# Altium project DC075B.PrjPcb (part 4 of 7)

## Sheet DC075B_ANALOG_INPUTS.SchDoc: ANALOG INPUTS
size 558 x 431 mm; DrawnBy: Praveen Aroul; DocumentNumber: 5; SheetNumber: 5; SheetTotal: 13; PageSetup: Record=PageOptions|CenterHorizontal=True|CenterVertical=True|PrintScale=1.00|XCorrection=1.00|YCorrection=1.00|PrintKind=0|BorderSize=5000000|LeftOffset=0|BottomOffset=0|Orientation=2|PaperLength=1000|PaperWidth=1000|Scale=100|PaperSource=15|PrintQuality=600|MediaType=1|DitherType=10|PaperKind=Letter|PrintScaleMode=1
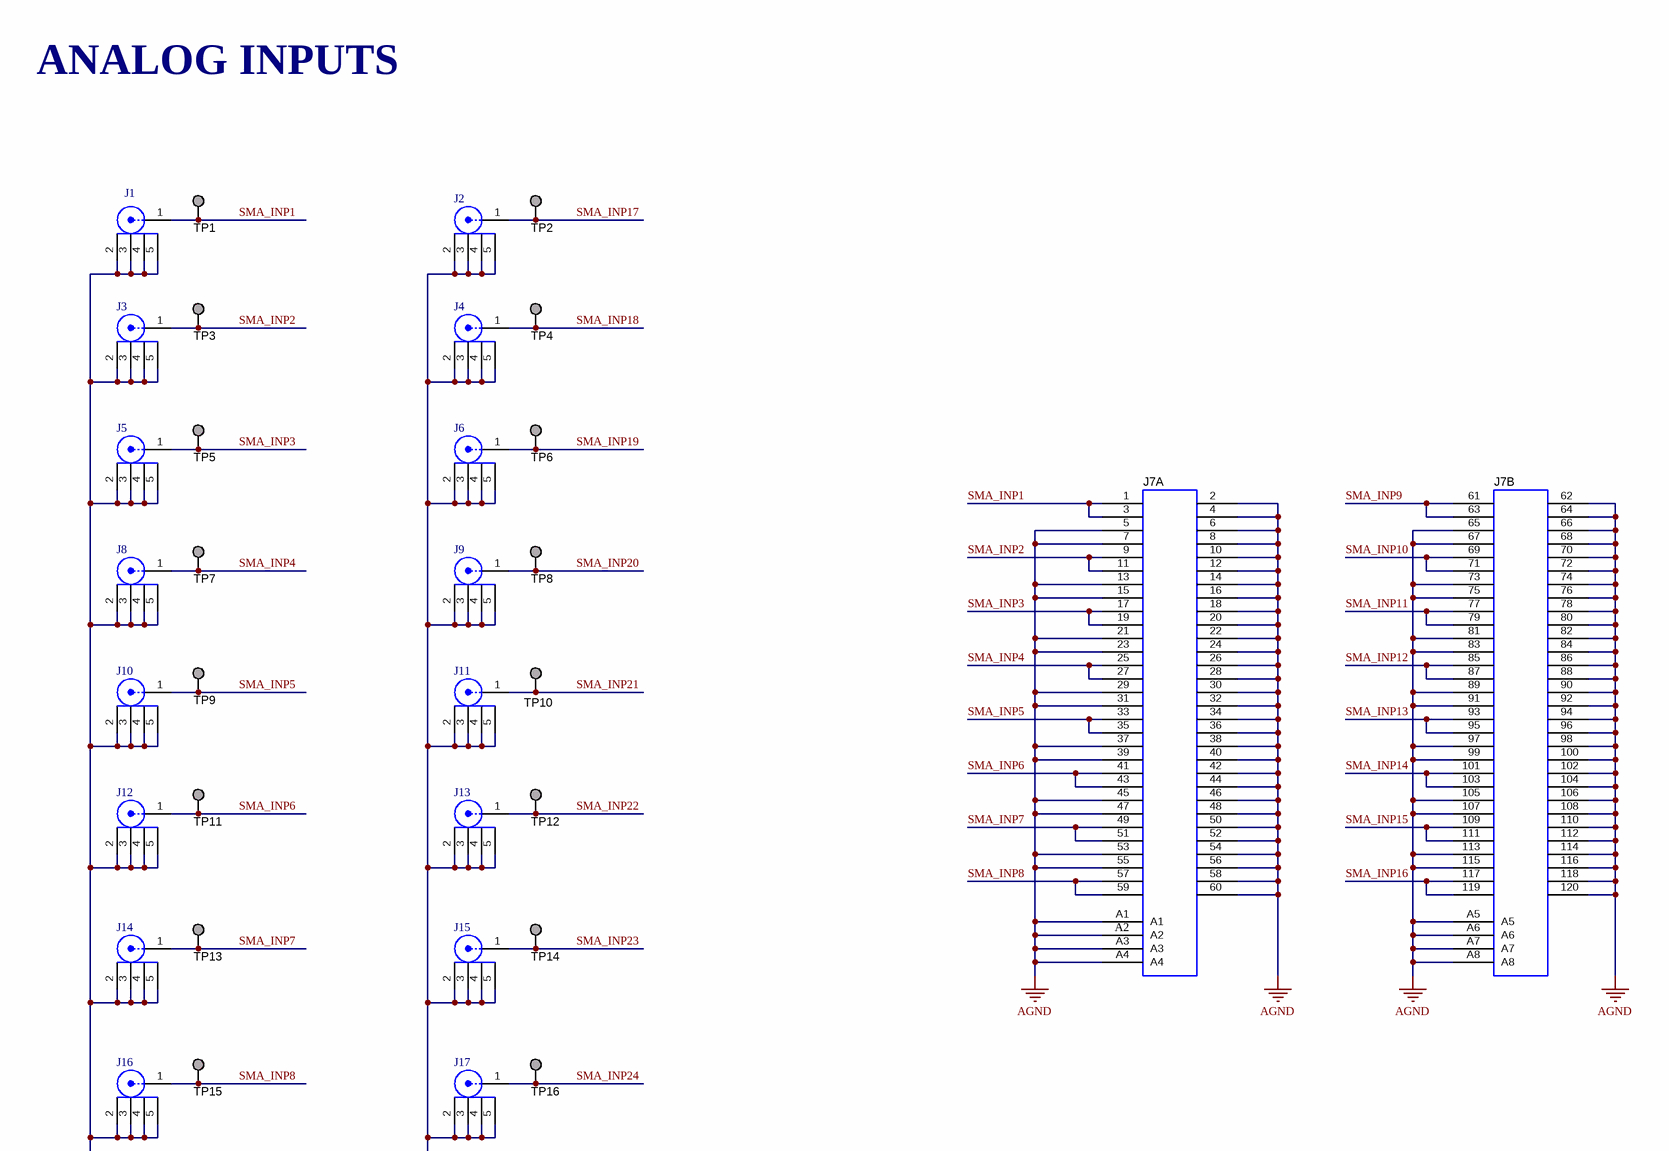
[diagram p11: DC075B_ANALOG_INPUTS.SchDoc, top left]
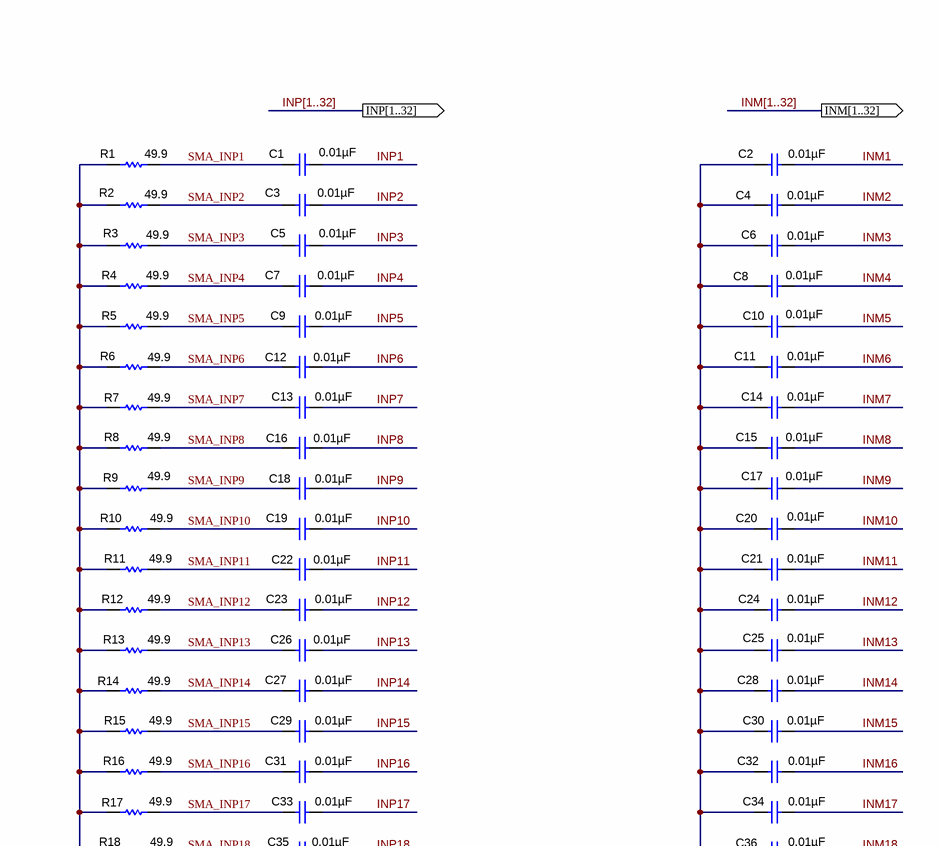
[diagram p12: DC075B_ANALOG_INPUTS.SchDoc, top right]
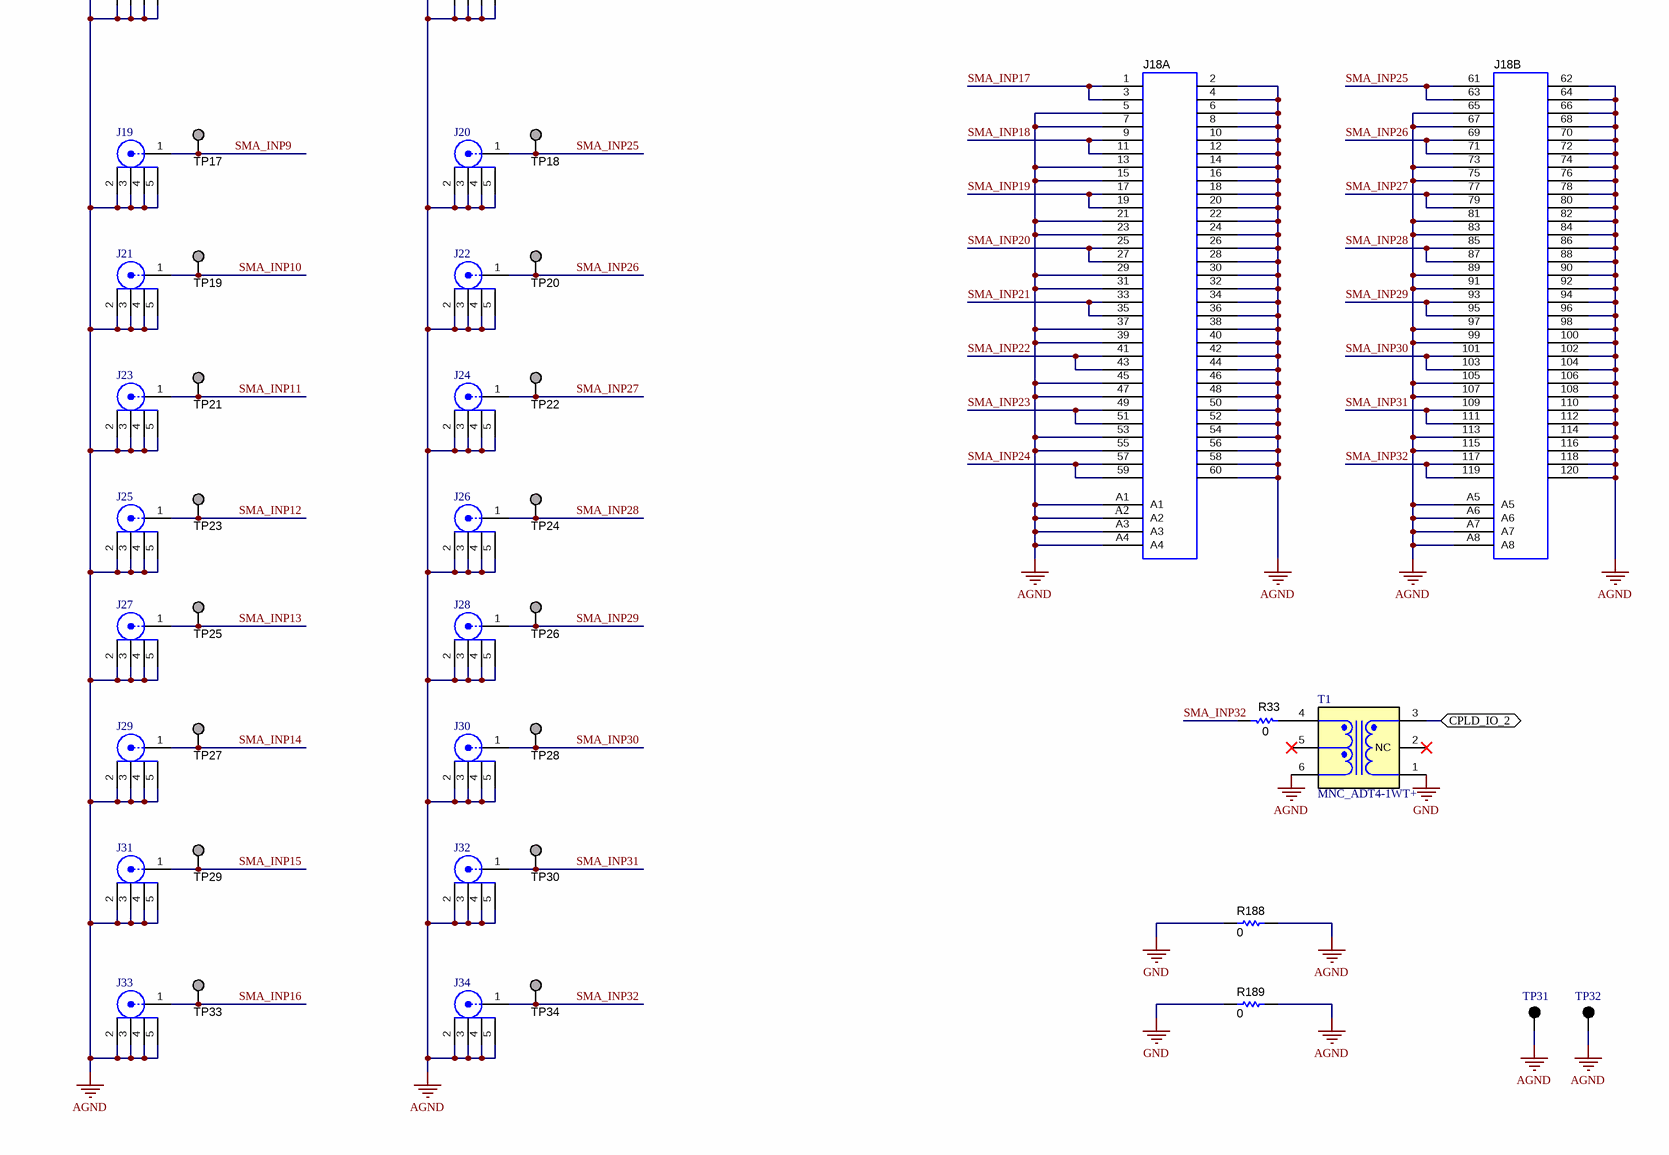
[diagram p13: DC075B_ANALOG_INPUTS.SchDoc, bottom left]
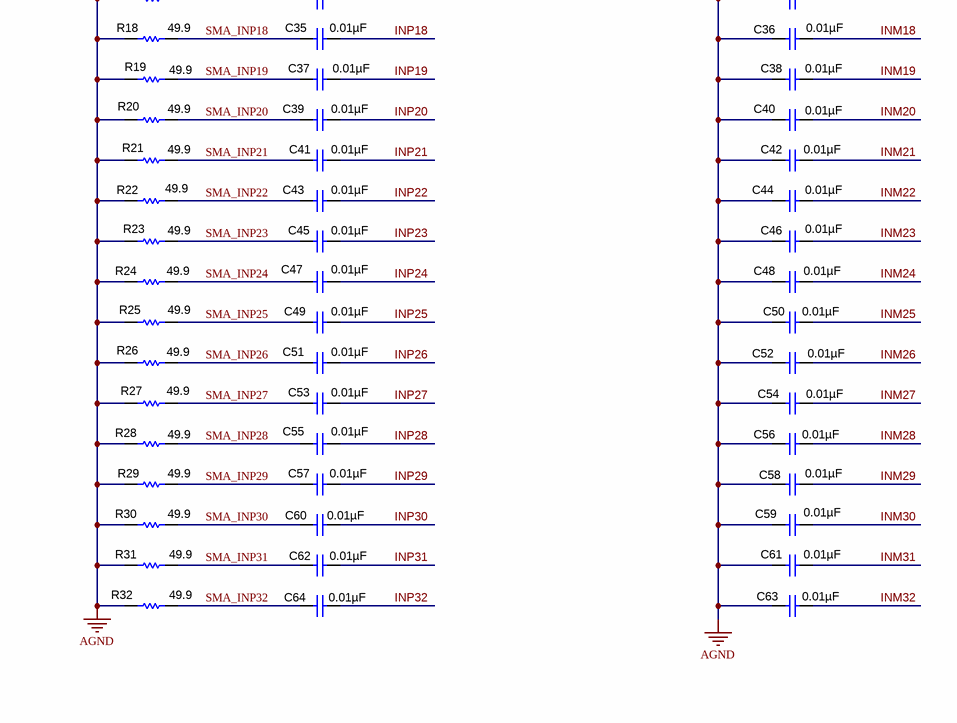
[diagram p14: DC075B_ANALOG_INPUTS.SchDoc, bottom right]

### Parts
C1  ValueDisplayed: 0.01µF  [0402]  (hidden comment: 04023C103JAT2A)
C2  ValueDisplayed: 0.01µF  [0402]  (hidden comment: 04023C103JAT2A)
C3  ValueDisplayed: 0.01µF  [0402]  (hidden comment: 04023C103JAT2A)
C4  ValueDisplayed: 0.01µF  [0402]  (hidden comment: 04023C103JAT2A)
C5  ValueDisplayed: 0.01µF  [0402]  (hidden comment: 04023C103JAT2A)
C6  ValueDisplayed: 0.01µF  [0402]  (hidden comment: 04023C103JAT2A)
C7  ValueDisplayed: 0.01µF  [0402]  (hidden comment: 04023C103JAT2A)
C8  ValueDisplayed: 0.01µF  [0402]  (hidden comment: 04023C103JAT2A)
C9  ValueDisplayed: 0.01µF  [0402]  (hidden comment: 04023C103JAT2A)
C10  ValueDisplayed: 0.01µF  [0402]  (hidden comment: 04023C103JAT2A)
C11  ValueDisplayed: 0.01µF  [0402]  (hidden comment: 04023C103JAT2A)
C12  ValueDisplayed: 0.01µF  [0402]  (hidden comment: 04023C103JAT2A)
C13  ValueDisplayed: 0.01µF  [0402]  (hidden comment: 04023C103JAT2A)
C14  ValueDisplayed: 0.01µF  [0402]  (hidden comment: 04023C103JAT2A)
C15  ValueDisplayed: 0.01µF  [0402]  (hidden comment: 04023C103JAT2A)
C16  ValueDisplayed: 0.01µF  [0402]  (hidden comment: 04023C103JAT2A)
C17  ValueDisplayed: 0.01µF  [0402]  (hidden comment: 04023C103JAT2A)
C18  ValueDisplayed: 0.01µF  [0402]  (hidden comment: 04023C103JAT2A)
C19  ValueDisplayed: 0.01µF  [0402]  (hidden comment: 04023C103JAT2A)
C20  ValueDisplayed: 0.01µF  [0402]  (hidden comment: 04023C103JAT2A)
C21  ValueDisplayed: 0.01µF  [0402]  (hidden comment: 04023C103JAT2A)
C22  ValueDisplayed: 0.01µF  [0402]  (hidden comment: 04023C103JAT2A)
C23  ValueDisplayed: 0.01µF  [0402]  (hidden comment: 04023C103JAT2A)
C24  ValueDisplayed: 0.01µF  [0402]  (hidden comment: 04023C103JAT2A)
C25  ValueDisplayed: 0.01µF  [0402]  (hidden comment: 04023C103JAT2A)
C26  ValueDisplayed: 0.01µF  [0402]  (hidden comment: 04023C103JAT2A)
C27  ValueDisplayed: 0.01µF  [0402]  (hidden comment: 04023C103JAT2A)
C28  ValueDisplayed: 0.01µF  [0402]  (hidden comment: 04023C103JAT2A)
C29  ValueDisplayed: 0.01µF  [0402]  (hidden comment: 04023C103JAT2A)
C30  ValueDisplayed: 0.01µF  [0402]  (hidden comment: 04023C103JAT2A)
C31  ValueDisplayed: 0.01µF  [0402]  (hidden comment: 04023C103JAT2A)
C32  ValueDisplayed: 0.01µF  [0402]  (hidden comment: 04023C103JAT2A)
C33  ValueDisplayed: 0.01µF  [0402]  (hidden comment: 04023C103JAT2A)
C34  ValueDisplayed: 0.01µF  [0402]  (hidden comment: 04023C103JAT2A)
C35  ValueDisplayed: 0.01µF  [0402]  (hidden comment: 04023C103JAT2A)
C36  ValueDisplayed: 0.01µF  [0402]  (hidden comment: 04023C103JAT2A)
C37  ValueDisplayed: 0.01µF  [0402]  (hidden comment: 04023C103JAT2A)
C38  ValueDisplayed: 0.01µF  [0402]  (hidden comment: 04023C103JAT2A)
C39  ValueDisplayed: 0.01µF  [0402]  (hidden comment: 04023C103JAT2A)
C40  ValueDisplayed: 0.01µF  [0402]  (hidden comment: 04023C103JAT2A)
C41  ValueDisplayed: 0.01µF  [0402]  (hidden comment: 04023C103JAT2A)
C42  ValueDisplayed: 0.01µF  [0402]  (hidden comment: 04023C103JAT2A)
C43  ValueDisplayed: 0.01µF  [0402]  (hidden comment: 04023C103JAT2A)
C44  ValueDisplayed: 0.01µF  [0402]  (hidden comment: 04023C103JAT2A)
C45  ValueDisplayed: 0.01µF  [0402]  (hidden comment: 04023C103JAT2A)
C46  ValueDisplayed: 0.01µF  [0402]  (hidden comment: 04023C103JAT2A)
C47  ValueDisplayed: 0.01µF  [0402]  (hidden comment: 04023C103JAT2A)
C48  ValueDisplayed: 0.01µF  [0402]  (hidden comment: 04023C103JAT2A)
C49  ValueDisplayed: 0.01µF  [0402]  (hidden comment: 04023C103JAT2A)
C50  ValueDisplayed: 0.01µF  [0402]  (hidden comment: 04023C103JAT2A)
C51  ValueDisplayed: 0.01µF  [0402]  (hidden comment: 04023C103JAT2A)
C52  ValueDisplayed: 0.01µF  [0402]  (hidden comment: 04023C103JAT2A)
C53  ValueDisplayed: 0.01µF  [0402]  (hidden comment: 04023C103JAT2A)
C54  ValueDisplayed: 0.01µF  [0402]  (hidden comment: 04023C103JAT2A)
C55  ValueDisplayed: 0.01µF  [0402]  (hidden comment: 04023C103JAT2A)
C56  ValueDisplayed: 0.01µF  [0402]  (hidden comment: 04023C103JAT2A)
C57  ValueDisplayed: 0.01µF  [0402]  (hidden comment: 04023C103JAT2A)
C58  ValueDisplayed: 0.01µF  [0402]  (hidden comment: 04023C103JAT2A)
C59  ValueDisplayed: 0.01µF  [0402]  (hidden comment: 04023C103JAT2A)
C60  ValueDisplayed: 0.01µF  [0402]  (hidden comment: 04023C103JAT2A)
C61  ValueDisplayed: 0.01µF  [0402]  (hidden comment: 04023C103JAT2A)
C62  ValueDisplayed: 0.01µF  [0402]  (hidden comment: 04023C103JAT2A)
C63  ValueDisplayed: 0.01µF  [0402]  (hidden comment: 04023C103JAT2A)
C64  ValueDisplayed: 0.01µF  [0402]  (hidden comment: 04023C103JAT2A)
J1  SMA_Contact1_GND2345  [Johnson_142-0701-801]  (value not drawn)
J2  5-1814832-1  [TE_5-1814832-1]  (value not drawn)
J3  5-1814832-1  [TE_5-1814832-1]  (value not drawn)
J4  SMA_Contact1_GND2345  [Johnson_142-0701-801]  (value not drawn)
J5  5-1814832-1  [TE_5-1814832-1]  (value not drawn)
J6  5-1814832-1  [TE_5-1814832-1]  (value not drawn)
J7  SAMTEC_QTH-060-01-L-D-A  [SAMTEC_QTH-060-01-L-D-A]  (value not drawn)  (parts A,B of 2)
J8  SMA_Contact1_GND2345  [Johnson_142-0701-801]  (value not drawn)
J9  5-1814832-1  [TE_5-1814832-1]  (value not drawn)
J10  5-1814832-1  [TE_5-1814832-1]  (value not drawn)
J11  SMA_Contact1_GND2345  [Johnson_142-0701-801]  (value not drawn)
J12  5-1814832-1  [TE_5-1814832-1]  (value not drawn)
J13  5-1814832-1  [TE_5-1814832-1]  (value not drawn)
J14  SMA_Contact1_GND2345  [Johnson_142-0701-801]  (value not drawn)
J15  5-1814832-1  [TE_5-1814832-1]  (value not drawn)
J16  5-1814832-1  [TE_5-1814832-1]  (value not drawn)
J17  SMA_Contact1_GND2345  [Johnson_142-0701-801]  (value not drawn)
J18  SAMTEC_QTH-060-01-L-D-A  [SAMTEC_QTH-060-01-L-D-A]  (value not drawn)  (parts A,B of 2)
J19  5-1814832-1  [TE_5-1814832-1]  (value not drawn)
J20  5-1814832-1  [TE_5-1814832-1]  (value not drawn)
J21  SMA_Contact1_GND2345  [Johnson_142-0701-801]  (value not drawn)
J22  5-1814832-1  [TE_5-1814832-1]  (value not drawn)
J23  5-1814832-1  [TE_5-1814832-1]  (value not drawn)
J24  SMA_Contact1_GND2345  [Johnson_142-0701-801]  (value not drawn)
J25  5-1814832-1  [TE_5-1814832-1]  (value not drawn)
J26  5-1814832-1  [TE_5-1814832-1]  (value not drawn)
J27  SMA_Contact1_GND2345  [Johnson_142-0701-801]  (value not drawn)
J28  5-1814832-1  [TE_5-1814832-1]  (value not drawn)
J29  5-1814832-1  [TE_5-1814832-1]  (value not drawn)
J30  SMA_Contact1_GND2345  [Johnson_142-0701-801]  (value not drawn)
J31  5-1814832-1  [TE_5-1814832-1]  (value not drawn)
J32  5-1814832-1  [TE_5-1814832-1]  (value not drawn)
J33  5-1814832-1  [TE_5-1814832-1]  (value not drawn)
J34  5-1814832-1  [TE_5-1814832-1]  (value not drawn)
R1  value 49.9  [0402]  (hidden comment: Resistor)
R2  value 49.9  [0402]  (hidden comment: Resistor)
R3  value 49.9  [0402]  (hidden comment: Resistor)
R4  value 49.9  [0402]  (hidden comment: Resistor)
R5  value 49.9  [0402]  (hidden comment: Resistor)
R6  value 49.9  [0402]  (hidden comment: Resistor)
R7  value 49.9  [0402]  (hidden comment: Resistor)
R8  value 49.9  [0402]  (hidden comment: Resistor)
R9  value 49.9  [0402]  (hidden comment: Resistor)
R10  value 49.9  [0402]  (hidden comment: Resistor)
R11  value 49.9  [0402]  (hidden comment: Resistor)
R12  value 49.9  [0402]  (hidden comment: Resistor)
R13  value 49.9  [0402]  (hidden comment: Resistor)
R14  value 49.9  [0402]  (hidden comment: Resistor)
R15  value 49.9  [0402]  (hidden comment: Resistor)
R16  value 49.9  [0402]  (hidden comment: Resistor)
R17  value 49.9  [0402]  (hidden comment: Resistor)
R18  value 49.9  [0402]  (hidden comment: Resistor)
R19  value 49.9  [0402]  (hidden comment: Resistor)
R20  value 49.9  [0402]  (hidden comment: Resistor)
R21  value 49.9  [0402]  (hidden comment: Resistor)
R22  value 49.9  [0402]  (hidden comment: Resistor)
R23  value 49.9  [0402]  (hidden comment: Resistor)
R24  value 49.9  [0402]  (hidden comment: Resistor)
R25  value 49.9  [0402]  (hidden comment: Resistor)
R26  value 49.9  [0402]  (hidden comment: Resistor)
R27  value 49.9  [0402]  (hidden comment: Resistor)
R28  value 49.9  [0402]  (hidden comment: Resistor)
R29  value 49.9  [0402]  (hidden comment: Resistor)
R30  value 49.9  [0402]  (hidden comment: Resistor)
R31  value 49.9  [0402]  (hidden comment: Resistor)
R32  value 49.9  [0402]  (hidden comment: Resistor)
R33  value 0  [0402]  (hidden comment: Resistor)
R188  ValueDisplayed: 0  [0805_HV]  (hidden comment: Resistor)
R189  ValueDisplayed: 0  [0805_HV]  (hidden comment: Resistor)
T1  MNC_ADT4-1WT+  [MNC_CD542]
TP1  Testpoint_Gray  [Keystone_5019]  (value not drawn)
TP2  Testpoint_Gray  [Keystone_5019]  (value not drawn)
TP3  Testpoint_Gray  [Keystone_5019]  (value not drawn)
TP4  Testpoint_Gray  [Keystone_5019]  (value not drawn)
TP5  Testpoint_Gray  [Keystone_5019]  (value not drawn)
TP6  Testpoint_Gray  [Keystone_5019]  (value not drawn)
TP7  Testpoint_Gray  [Keystone_5019]  (value not drawn)
TP8  Testpoint_Gray  [Keystone_5019]  (value not drawn)
TP9  Testpoint_Gray  [Keystone_5019]  (value not drawn)
TP10  Testpoint_Gray  [Keystone_5019]  (value not drawn)
TP11  Testpoint_Gray  [Keystone_5019]  (value not drawn)
TP12  Testpoint_Gray  [Keystone_5019]  (value not drawn)
TP13  Testpoint_Gray  [Keystone_5019]  (value not drawn)
TP14  Testpoint_Gray  [Keystone_5019]  (value not drawn)
TP15  Testpoint_Gray  [Keystone_5019]  (value not drawn)
TP16  Testpoint_Gray  [Keystone_5019]  (value not drawn)
TP17  Testpoint_Gray  [Keystone_5019]  (value not drawn)
TP18  Testpoint_Gray  [Keystone_5019]  (value not drawn)
TP19  Testpoint_Gray  [Keystone_5019]  (value not drawn)
TP20  Testpoint_Gray  [Keystone_5019]  (value not drawn)
TP21  Testpoint_Gray  [Keystone_5019]  (value not drawn)
TP22  Testpoint_Gray  [Keystone_5019]  (value not drawn)
TP23  Testpoint_Gray  [Keystone_5019]  (value not drawn)
TP24  Testpoint_Gray  [Keystone_5019]  (value not drawn)
TP25  Testpoint_Gray  [Keystone_5019]  (value not drawn)
TP26  Testpoint_Gray  [Keystone_5019]  (value not drawn)
TP27  Testpoint_Gray  [Keystone_5019]  (value not drawn)
TP28  Testpoint_Gray  [Keystone_5019]  (value not drawn)
TP29  Testpoint_Gray  [Keystone_5019]  (value not drawn)
TP30  Testpoint_Gray  [Keystone_5019]  (value not drawn)
TP31  5001  [Keystone5001]  (value not drawn)
TP32  5001  [Keystone5001]  (value not drawn)
TP33  Testpoint_Gray  [Keystone_5019]  (value not drawn)
TP34  Testpoint_Gray  [Keystone_5019]  (value not drawn)

### Ports
CPLD_IO_2, INM[1..32] (out), INP[1..32] (out)

### Nets
AGND: C2.2 C4.2 C6.2 C8.2 C10.2 C11.2 C14.2 C15.2 C17.2 C20.2 C21.2 C24.2 C25.2 C28.2 C30.2 C32.2 C34.2 C36.2 C38.2 C40.2 C42.2 C44.2 C46.2 C48.2 C50.2 C52.2 C54.2 C56.2 C58.2 C59.2 C61.2 C63.2 J1.2 J1.3 J1.4 J1.5 J2.2 J2.3 J2.4 J2.5 J3.2 J3.3 J3.4 J3.5 J4.2 J4.3 J4.4 J4.5 J5.2 J5.3 J5.4 J5.5 J6.2 J6.3 J6.4 J6.5 J7.2 J7.4 J7.5 J7.6 J7.7 J7.8 J7.10 J7.12 J7.13 J7.14 J7.15 J7.16 J7.18 J7.20 J7.21 J7.22 J7.23 J7.24 J7.26 J7.28 J7.29 J7.30 J7.31 J7.32 J7.34 J7.36 J7.37 J7.38 J7.39 J7.40 J7.42 J7.44 J7.45 J7.46 J7.47 J7.48 J7.50 J7.52 J7.53 J7.54 J7.55 J7.56 J7.58 J7.60 J7.62 J7.64 J7.65 J7.66 J7.67 J7.68 J7.70 J7.72 J7.73 J7.74 J7.75 J7.76 J7.78 J7.80 J7.81 J7.82 J7.83 J7.84 J7.86 J7.88 J7.89 J7.90 J7.91 J7.92 J7.94 J7.96 J7.97 J7.98 J7.99 J7.100 J7.102 J7.104 J7.105 J7.106 J7.107 J7.108 J7.110 J7.112 J7.113 J7.114 J7.115 J7.116 J7.118 J7.120 J7.A1 J7.A2 J7.A3 J7.A4 J7.A5 J7.A6 J7.A7 J7.A8 J8.2 J8.3 J8.4 J8.5 J9.2 J9.3 J9.4 J9.5 J10.2 J10.3 J10.4 J10.5 J11.2 J11.3 J11.4 J11.5 J12.2 J12.3 J12.4 J12.5 J13.2 J13.3 J13.4 J13.5 J14.2 J14.3 J14.4 J14.5 J15.2 J15.3 J15.4 J15.5 J16.2 J16.3 J16.4 J16.5 J17.2 J17.3 J17.4 J17.5 J18.2 J18.4 J18.5 J18.6 J18.7 J18.8 J18.10 J18.12 J18.13 J18.14 J18.15 J18.16 J18.18 J18.20 J18.21 J18.22 J18.23 J18.24 J18.26 J18.28 J18.29 J18.30 J18.31 J18.32 J18.34 J18.36 J18.37 J18.38 J18.39 J18.40 J18.42 J18.44 J18.45 J18.46 J18.47 J18.48 J18.50 J18.52 J18.53 J18.54 J18.55 J18.56 J18.58 J18.60 J18.62 J18.64 J18.65 J18.66 J18.67 J18.68 J18.70 J18.72 J18.73 J18.74 J18.75 J18.76 J18.78 J18.80 J18.81 J18.82 J18.83 J18.84 J18.86 J18.88 J18.89 J18.90 J18.91 J18.92 J18.94 J18.96 J18.97 J18.98 J18.99 J18.100 J18.102 J18.104 J18.105 J18.106 J18.107 J18.108 J18.110 J18.112 J18.113 J18.114 J18.115 J18.116 J18.118 J18.120 J18.A1 J18.A2 J18.A3 J18.A4 J18.A5 J18.A6 J18.A7 J18.A8 J19.2 J19.3 J19.4 J19.5 J20.2 J20.3 J20.4 J20.5 J21.2 J21.3 J21.4 J21.5 J22.2 J22.3 J22.4 J22.5 J23.2 J23.3 J23.4 J23.5 J24.2 J24.3 J24.4 J24.5 J25.2 J25.3 J25.4 J25.5 J26.2 J26.3 J26.4 J26.5 J27.2 J27.3 J27.4 J27.5 J28.2 J28.3 J28.4 J28.5 J29.2 J29.3 J29.4 J29.5 J30.2 J30.3 J30.4 J30.5 J31.2 J31.3 J31.4 J31.5 J32.2 J32.3 J32.4 J32.5 J33.2 J33.3 J33.4 J33.5 J34.2 J34.3 J34.4 J34.5 R1.1 R2.1 R3.1 R4.1 R5.1 R6.1 R7.1 R8.1 R9.1 R10.1 R11.1 R12.1 R13.1 R14.1 R15.1 R16.1 R17.1 R18.1 R19.1 R20.1 R21.1 R22.1 R23.1 R24.1 R25.1 R26.1 R27.1 R28.1 R29.1 R30.1 R31.1 R32.1 R188.2 R189.2 T1.6 TP31.1 TP32.1
GND: R188.1 R189.1 T1.1
CPLD_IO_2: T1.3 ; port CPLD_IO_2
INM1: C2.1
INM2: C4.1
INM3: C6.1
INM4: C8.1
INM5: C10.1
INM6: C11.1
INM7: C14.1
INM8: C15.1
INM9: C17.1
INM10: C20.1
INM11: C21.1
INM12: C24.1
INM13: C25.1
INM14: C28.1
INM15: C30.1
INM16: C32.1
INM17: C34.1
INM18: C36.1
INM19: C38.1
INM20: C40.1
INM21: C42.1
INM22: C44.1
INM23: C46.1
INM24: C48.1
INM25: C50.1
INM26: C52.1
INM27: C54.1
INM28: C56.1
INM29: C58.1
INM30: C59.1
INM31: C61.1
INM32: C63.1
INP1: C1.1
INP2: C3.1
INP3: C5.1
INP4: C7.1
INP5: C9.1
INP6: C12.1
INP7: C13.1
INP8: C16.1
INP9: C18.1
INP10: C19.1
INP11: C22.1
INP12: C23.1
INP13: C26.1
INP14: C27.1
INP15: C29.1
INP16: C31.1
INP17: C33.1
INP18: C35.1
INP19: C37.1
INP20: C39.1
INP21: C41.1
INP22: C43.1
INP23: C45.1
INP24: C47.1
INP25: C49.1
INP26: C51.1
INP27: C53.1
INP28: C55.1
INP29: C57.1
INP30: C60.1
INP31: C62.1
INP32: C64.1
SMA_INP1: C1.2 J1.1 J7.1 J7.3 R1.2 TP1.1
SMA_INP2: C3.2 J3.1 J7.9 J7.11 R2.2 TP3.1
SMA_INP3: C5.2 J5.1 J7.17 J7.19 R3.2 TP5.1
SMA_INP4: C7.2 J7.25 J7.27 J8.1 R4.2 TP7.1
SMA_INP5: C9.2 J7.33 J7.35 J10.1 R5.2 TP9.1
SMA_INP6: C12.2 J7.41 J7.43 J12.1 R6.2 TP11.1
SMA_INP7: C13.2 J7.49 J7.51 J14.1 R7.2 TP13.1
SMA_INP8: C16.2 J7.57 J7.59 J16.1 R8.2 TP15.1
SMA_INP9: C18.2 J7.61 J7.63 J19.1 R9.2 TP17.1
SMA_INP10: C19.2 J7.69 J7.71 J21.1 R10.2 TP19.1
SMA_INP11: C22.2 J7.77 J7.79 J23.1 R11.2 TP21.1
SMA_INP12: C23.2 J7.85 J7.87 J25.1 R12.2 TP23.1
SMA_INP13: C26.2 J7.93 J7.95 J27.1 R13.2 TP25.1
SMA_INP14: C27.2 J7.101 J7.103 J29.1 R14.2 TP27.1
SMA_INP15: C29.2 J7.109 J7.111 J31.1 R15.2 TP29.1
SMA_INP16: C31.2 J7.117 J7.119 J33.1 R16.2 TP33.1
SMA_INP17: C33.2 J2.1 J18.1 J18.3 R17.2 TP2.1
SMA_INP18: C35.2 J4.1 J18.9 J18.11 R18.2 TP4.1
SMA_INP19: C37.2 J6.1 J18.17 J18.19 R19.2 TP6.1
SMA_INP20: C39.2 J9.1 J18.25 J18.27 R20.2 TP8.1
SMA_INP21: C41.2 J11.1 J18.33 J18.35 R21.2 TP10.1
SMA_INP22: C43.2 J13.1 J18.41 J18.43 R22.2 TP12.1
SMA_INP23: C45.2 J15.1 J18.49 J18.51 R23.2 TP14.1
SMA_INP24: C47.2 J17.1 J18.57 J18.59 R24.2 TP16.1
SMA_INP25: C49.2 J18.61 J18.63 J20.1 R25.2 TP18.1
SMA_INP26: C51.2 J18.69 J18.71 J22.1 R26.2 TP20.1
SMA_INP27: C53.2 J18.77 J18.79 J24.1 R27.2 TP22.1
SMA_INP28: C55.2 J18.85 J18.87 J26.1 R28.2 TP24.1
SMA_INP29: C57.2 J18.93 J18.95 J28.1 R29.2 TP26.1
SMA_INP30: C60.2 J18.101 J18.103 J30.1 R30.2 TP28.1
SMA_INP31: C62.2 J18.109 J18.111 J32.1 R31.2 TP30.1
SMA_INP32: C64.2 J18.117 J18.119 J34.1 R32.2 R33.2 TP34.1
NetR33_1: R33.1 T1.4

Not connected (* = marked no-connect by the designer): T1 2(NC)* 5*

### Buses and harness runs
bus INM[1..32] = port INM[1..32]
bus INP[1..32] = port INP[1..32]

### Notes on the sheet
- ANALOG INPUTS
- Drawn By:
- SVN Rev:
- Number:
- TID #:
- Orderable:
- Rev:
- Sheet Title:
- File:
- Project Title:
- Designed for:
- Assembly Variant:
- Mod. Date:
- Sheet:
- Size:
- of
- C
- http://www.ti.com
- Texas Instruments and/or its licensors do not warrant the accuracy or completeness of this specification or any information contained therein. Texas Instruments and/or its licensors do not warrant that this design will meet the specifications, will be suitable for your application or fit for any particular purpose, or will operate in an implementation. Texas Instruments and/or its licensors do not warrant that the design is production worthy. You should completely validate and test your design implementation to confirm the system functionality for your application.
- Engineer:
- Contact:
- © Texas Instruments

### Library data of the parts
C1-C64 = CMP-0085568-1: CAP, CERM, 0.01 µF, 25 V,+/- 5%, X7R, 0402; Manufacturer: AVX; Polarized: N; Value: 0.01uF; U/M: EA; Cap_F: 10nF; VDC_V: 25V; TaMin_C: -55°C; TaMax_C: 125°C; AEC Category: Q200; SizeArea_mm2: 0.5; SizeAreaWB_mm2: 3; SizeX_mm: 1; SizeZ_mm: 0.6; CompType: Capacitor; PartNumber: 04023C103JAT2A; PackageReference: 0402; RoHS: Y; Tolerance_%: 5%; Value2: 25V; MountType: SMT; Technology: Ceramic; TempCo: X7R; Cap_Case: 0402; ComponentLink1Description: Datasheet link; ComponentLink1URL: http://datasheets.avx.com/X7RDielectric.pdf; AEC Grade: N/A; AEC Qualified: N; SizeY_mm: 0.5
J1 J4 J8 J11 J14 J17 J21 J24 J27 J30 = CMP-0055828-1: Connector, End launch SMA, 50 ohm, SMT; PartNumber: 142-0701-801; Manufacturer: Cinch Connectivity; CNHeader: FALSE; CT: TRUE; Green_Lifecycle: Not Set; Green_REACh: Incomplete; PackageReference: End Launch SMA; CompType: SMA; RoHS: Y; MountType: SMT; ComponentLink1Description: Datasheet URL; ComponentLink1URL: http://emersonconnectivity.com/OA_MEDIA/specs/pi-142-0701-801.pdf; Publisher: Texas Instruments; LatestRevisionDate: 26/05/2017; Supplier 1: Digi-Key; Supplier Part Number 1: J502-ND; Supplier 2: Newark; Supplier Part Number 2: 90F2624; Supplier 3: Mouser; Supplier Part Number 3: 530-142-0701-801; Green_EU RoHS-2: Incomplete; Green_EU RoHS: Incomplete
J2 J3 J5 J6 J9 J10 J12 J13 J15 J16 J19 J20 J22 J23 J25 J26 J28 J29 J31-J34 = CMP-0054990-1: SMA Straight PCB Socket Die Cast, 50 Ohm, TH; Manufacturer: TE Connectivity; Green_Lifecycle: Active; Green_REACh: Passed; CNHeader: FALSE; CT: TRUE; PartNumber: 5-1814832-1; PackageReference: SMA Straight PCB Socket Die Cast, TH; CompType: SMA; RoHS: Y; MountType: TH; ComponentLink1Description: Datasheet URL; ComponentLink1URL: http://www.te.com/commerce/DocumentDelivery/DDEController?Action=srchrtrv&DocNm=1814832&DocType=Customer+Drawing&DocLang=English; Supplier 1: Digi-Key; Supplier Part Number 1: A97594-ND; Supplier 2: Newark; Supplier Part Number 2: 78M7270; Supplier 3: Mouser; Supplier Part Number 3: 571-5-1814832-1; Green_EU RoHS-2: Incomplete; Green_EU RoHS: Passed with Exemption; Publisher: Texas Instruments; LatestRevisionDate: 26/05/2017
J7 J18 = CMP-0056023-2: Socket, 0.5MM, 60x2, Gold, SMT; Manufacturer: Samtec; Green_Lifecycle: Not Set; Green_REACh: Incomplete; PartNumber: QTH-060-01-L-D-A; PackageReference: Socket, Female, 0.5MM, 60x2, SMT; CompType: Socket; RoHS: Y; MountType: SMT; ComponentLink1Description: Datasheet URL; ComponentLink1URL: http://www.samtec.com/documents/webfiles/cpdf/QTH-XXX-XX-X-D-XXX-MKT.pdf; Supplier 1: Digi-Key; Supplier Part Number 1: SAM8189-ND; Supplier 2: Newark; Supplier Part Number 2: 11P6110; Supplier 3: Farnell; Supplier Part Number 3: 1667909; Green_EU RoHS-2: Incomplete; Green_EU RoHS: Incomplete
R1-R32 = CMP-0026404-2: RES, 49.9, 1%, 0.063 W, AEC-Q200 Grade 0, 0402; Manufacturer: Vishay-Dale; PartNumber: CRCW040249R9FKED; Value_Code: 49R9; Power_W: 63mW; Value2: 0.063W; VDC_V: 50V; TempCo: 100 ppm/C; EIA_Code: E96; AEC Category: Q200; AEC Grade: 0; AEC Qualified: Y; SizeArea_mm2: 0.5; SizeX_mm: 1; SizeZ_mm: 0.6; ComponentLink1Description: Datasheet link; ComponentLink1URL: http://www.vishay.com/docs/20035/dcrcwe3.pdf; CompType: Resistor; MountType: SMT; PackageReference: 0402; RoHS: E; ValueDisplayed: 49.9; Res_ohm: 49.9; Tolerance_%: 1%; Value1: 1%; Technology: Thick Film; Supplier 1: Digi-Key; Supplier Part Number 1: 541-49.9LCT-ND; Supplier 2: Newark; Supplier Part Number 2: 52K7114; Supplier 3: Mouser; Supplier Part Number 3: 71-CRCW0402-49.9-E3; SizeY_mm: 0.5
R33 = CMP-0026822-3: RES, 0, 5%, 0.063 W, AEC-Q200 Grade 0, 0402; Manufacturer: Vishay-Dale; PartNumber: CRCW04020000Z0ED; Value_Code: 0000; Power_W: 63mW; Value2: 0.063W; VDC_V: 50V; TempCo: 200 ppm/C; EIA_Code: E24; AEC Category: Q200; AEC Qualified: Y; SizeArea_mm2: 0.5; SizeX_mm: 1; SizeZ_mm: 0.6; ComponentLink1Description: Datasheet link; ComponentLink1URL: http://www.vishay.com/docs/20035/dcrcwe3.pdf; CompType: Resistor; MountType: SMT; PackageReference: 0402; RoHS: E; ValueDisplayed: 0; Res_ohm: 0; Tolerance_%: 5%; Value1: 5%; Technology: Thick Film; Supplier 1: Digi-Key; Supplier Part Number 1: 541-0.0JCT-ND; Supplier 2: Newark; Supplier Part Number 2: 52K6543; Supplier 3: Mouser; Supplier Part Number 3: 71-CRCW0402-0-E3; AEC Grade: 0; SizeY_mm: 0.5
R188 R189 = CMP-0020802-2: RES, 0, 5%, 0.125 W, 0805; PartNumber: MCR10EZPJ000; Manufacturer: Rohm; Value: 0; Value_Code: 0000; Power_W: 125mW; Value2: 0.125W; VDC_V: 150V; TempCo: 400 ppm/C; SizeArea_mm2: 2.5; SizeX_mm: 2; SizeY_mm: 1.25; SizeZ_mm: 1.45; EIA_Code: E24; U/M: EA; AEC Category: Q200; CompType: Resistor; PackageReference: 0805; RoHS: Y; Res_ohm: 0; Tolerance_%: 5%; Value1: 5%; MountType: SMT; Technology: Thick Film; Published: 2008-06-26; Publisher: Texas Instruments; LatestRevisionDate: 2017-03-09; ComponentLink1Description: Datasheet link; ComponentLink1URL: http://www.rohm.com/products/databook/r/pdf/mcr10.pdf; Supplier 1: Digi-Key; Supplier Part Number 1: RHM0.0ARCT-ND; AEC Qualified: ?
T1 = CMP-0030461-2: RF Transformer, 50 ohm, 2 to 775 MHz, SMT; Manufacturer: Minicircuits; Green_Lifecycle: Not Set; Green_REACh: Incomplete; PartNumber: ADT4-1WT+; CompType: Transformer; PackageReference: CD542; MountType: SMT; RoHS: Y; ComponentLink1Description: Datasheet URL; ComponentLink1URL: http://www.minicircuits.com/pdfs/ADT4-1WT.pdf; Publisher: Texas Instruments; LatestRevisionDate: 2017-05-09; Green_EU RoHS-2: Incomplete; Green_EU RoHS: Incomplete
TP1-TP30 TP33 TP34 = CMP-0055162-1: Test Point, Miniature, SMT; PartNumber: 5019; Manufacturer: Keystone; CNHeader: FALSE; CT: TRUE; Green_Lifecycle: Active; Green_REACh: Passed; CompType: Test Point; PackageReference: Test Point, Miniature, SMT; RoHS: Y; MountType: SMT; ComponentLink1Description: Datasheet URL; ComponentLink1URL: http://www.keyelco.com/product-pdf.cfm?p=1357; Publisher: Texas Instruments; LatestRevisionDate: 26/05/2017; Supplier 1: Digi-Key; Supplier Part Number 1: 36-5019TR-ND; Supplier 2: Mouser; Supplier Part Number 2: 534-5019; Green_EU RoHS-2: Incomplete; Green_EU RoHS: Passed
TP31 TP32 = CMP-0055138-1: Test Point, Miniature, Black, TH; Manufacturer: Keystone; CNHeader: FALSE; ContactFinish: Silver; CT: TRUE; Green_Lifecycle: Active; Green_REACh: Passed; PartNumber: 5001; PackageReference: Black Miniature Testpoint; CompType: Test Point; RoHS: Y; MountType: TH; ComponentLink1Description: Datasheet URL; ComponentLink1URL: http://www.keyelco.com/userAssets/file/M60-2p60.pdf; Publisher: Texas Instruments; LatestRevisionDate: 26/05/2017; Supplier 1: Digi-Key; Supplier Part Number 1: 36-5001-ND; Supplier 2: Mouser; Supplier Part Number 2: 534-5001; Color: Black; Green_EU RoHS-2: Incomplete; Green_EU RoHS: Passed

## Sheet DC075B_DEVICE_PINOUT.SchDoc: DEVICE PINOUT
size 558 x 431 mm; DrawnBy: Praveen Aroul; DocumentNumber: 6; SheetNumber: 6; SheetTotal: 13; PageSetup: Record=PageOptions|CenterHorizontal=True|CenterVertical=True|PrintScale=1.00|XCorrection=1.00|YCorrection=1.00|PrintKind=0|BorderSize=5000000|LeftOffset=0|BottomOffset=0|Orientation=2|PaperLength=1000|PaperWidth=1000|Scale=100|PaperSource=15|PrintQuality=600|MediaType=1|DitherType=10|PaperKind=Letter|PrintScaleMode=1
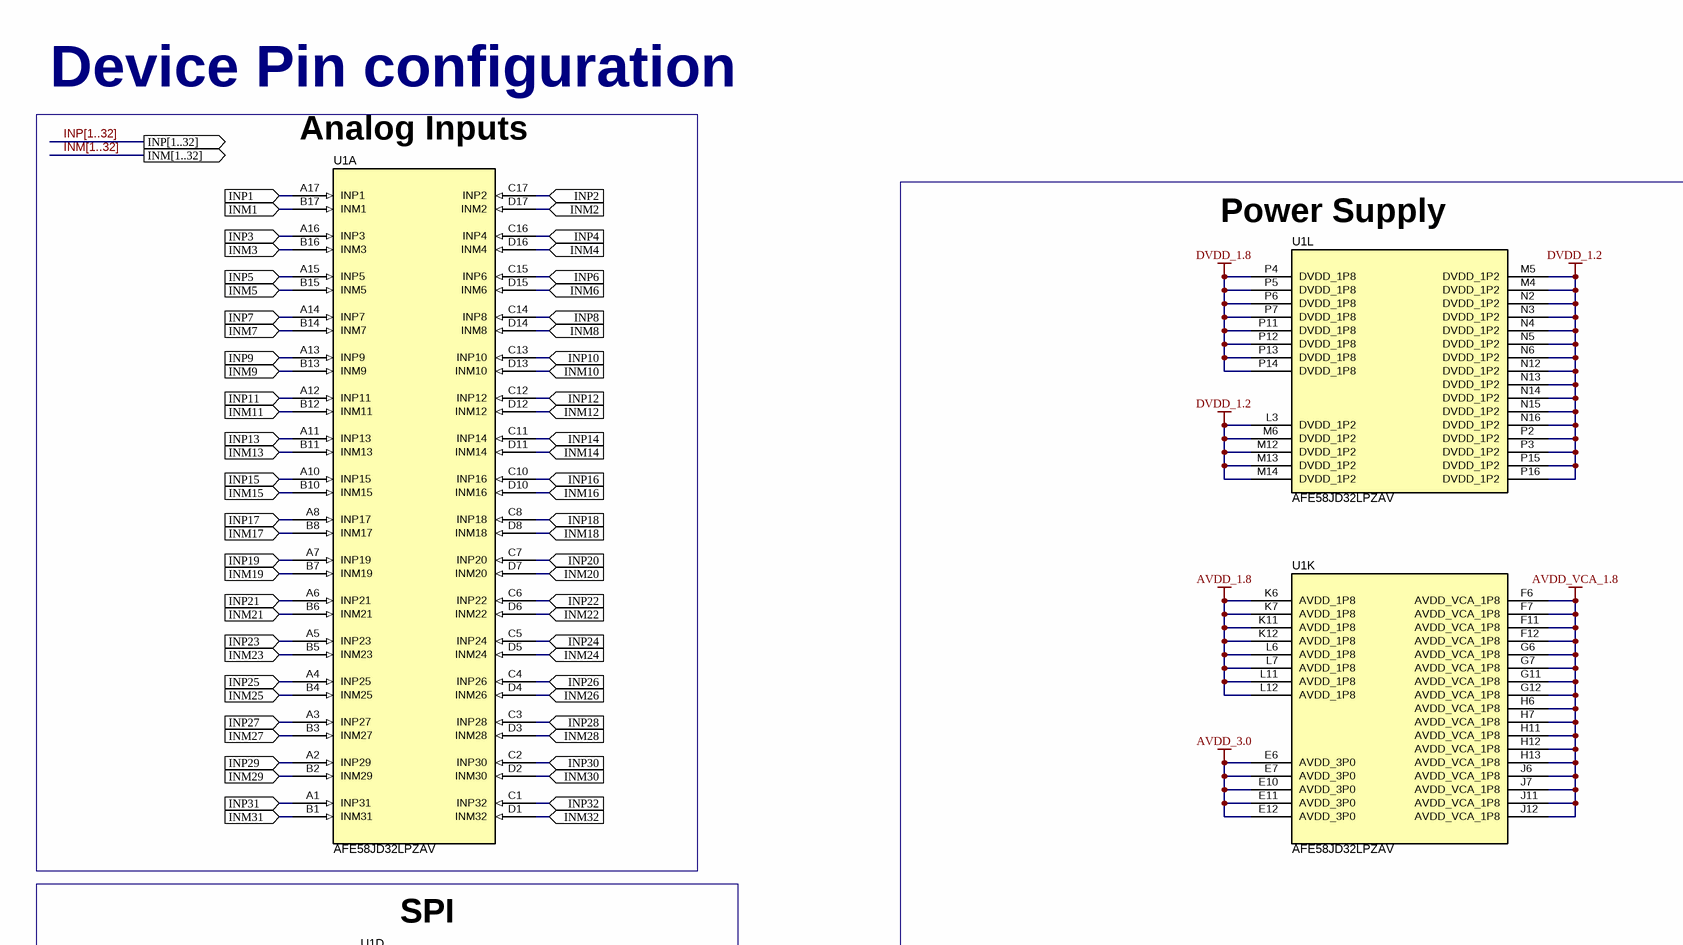
[diagram p15: DC075B_DEVICE_PINOUT.SchDoc, top left]
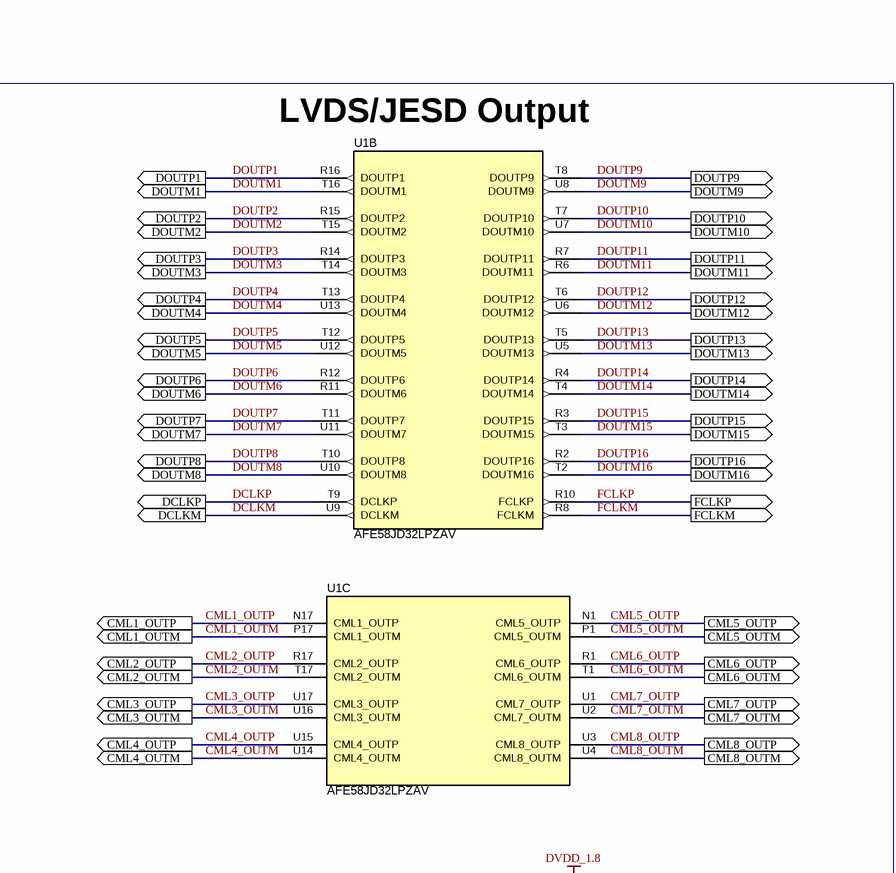
[diagram p16: DC075B_DEVICE_PINOUT.SchDoc, top right]
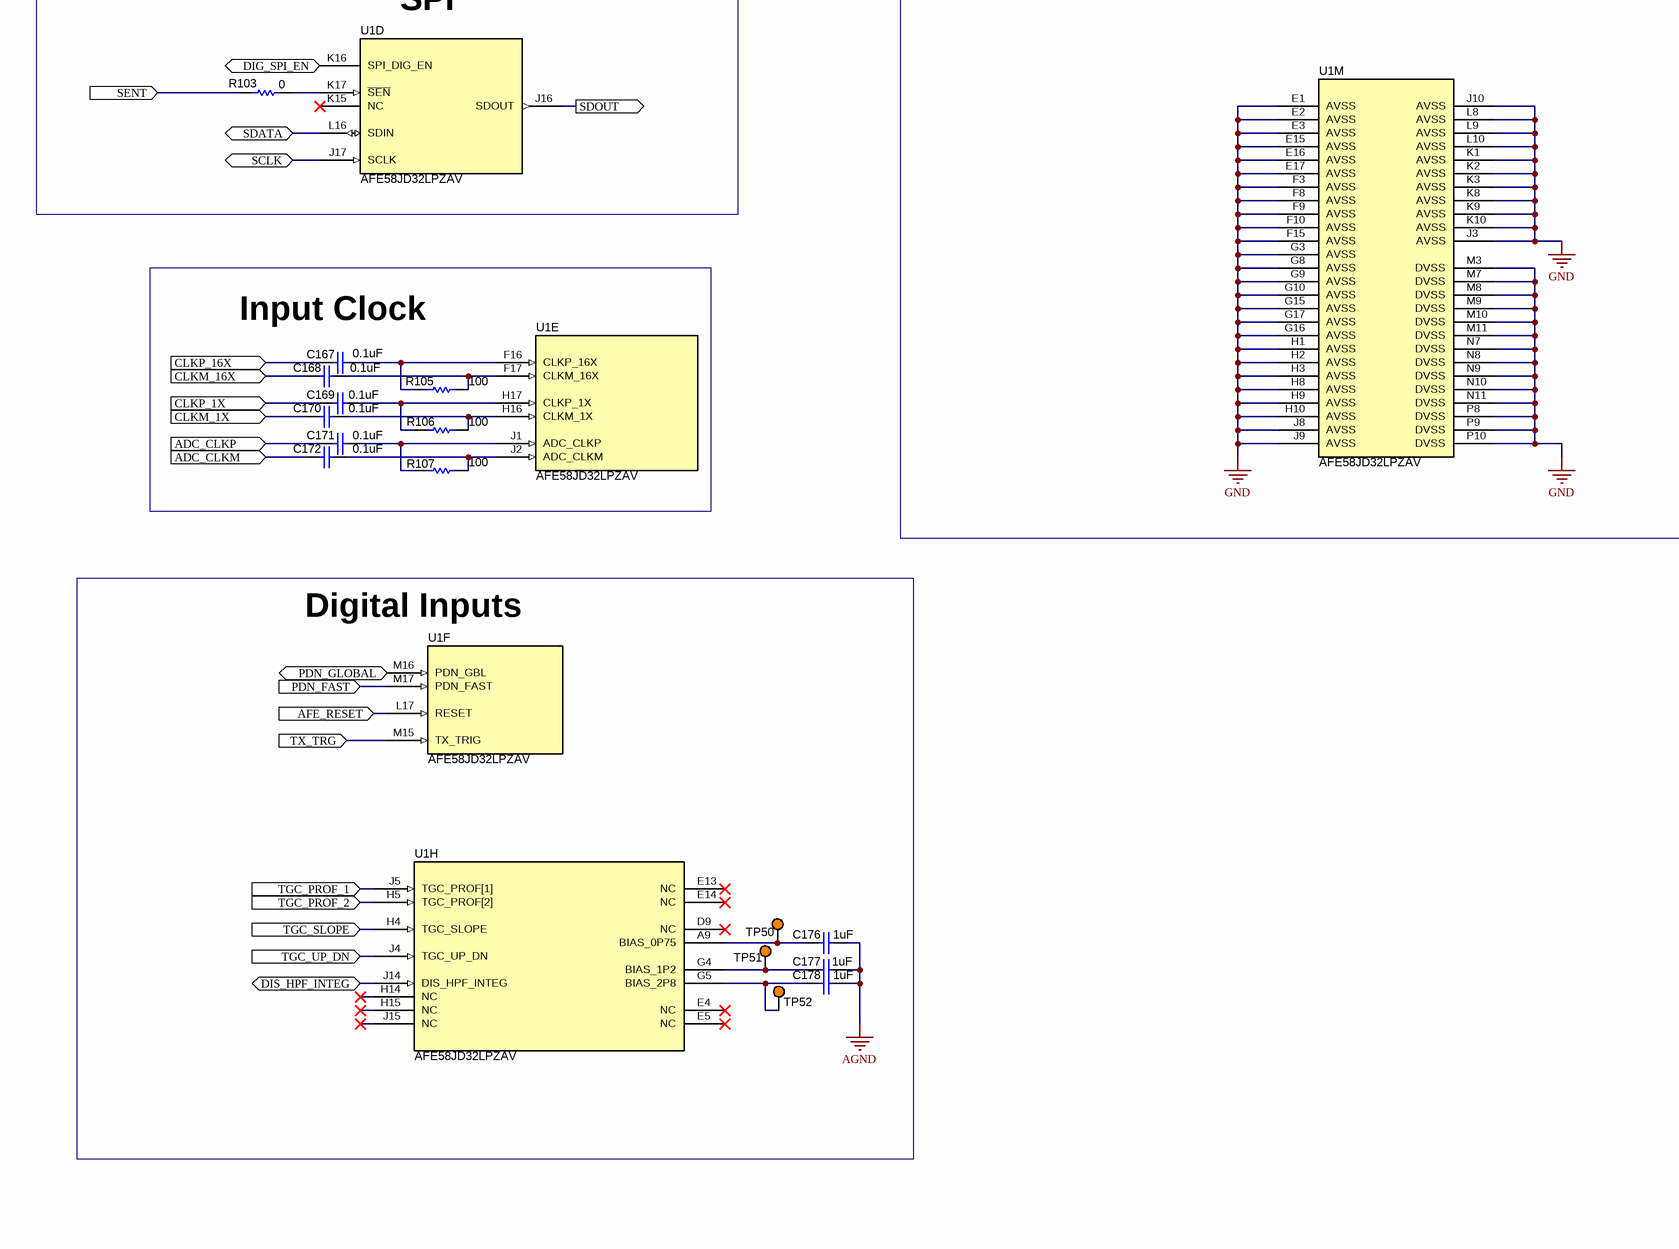
[diagram p17: DC075B_DEVICE_PINOUT.SchDoc, bottom left]
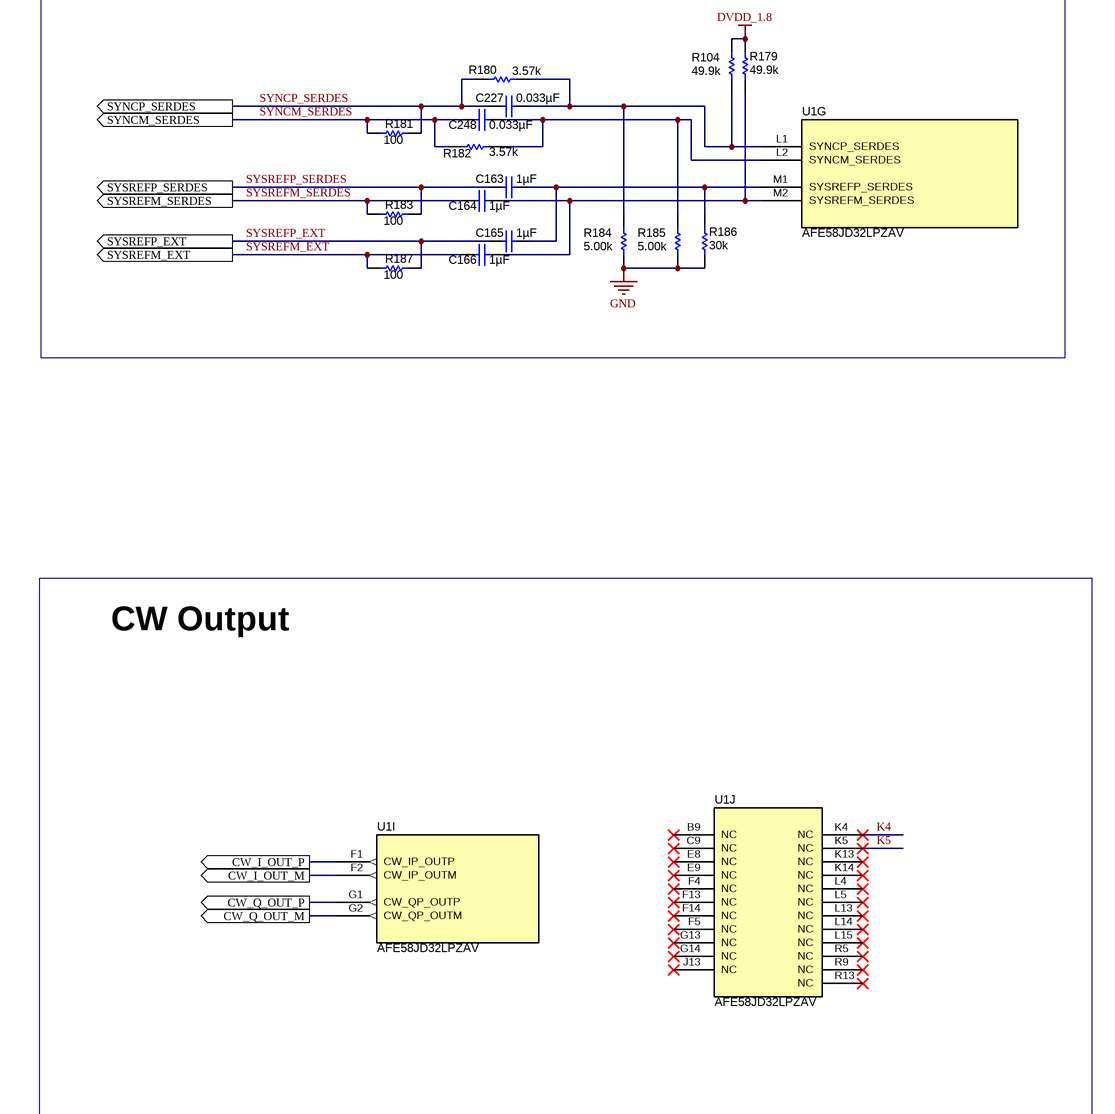
[diagram p18: DC075B_DEVICE_PINOUT.SchDoc, bottom right]

### Parts
C163  ValueDisplayed: 1µF  [0402]  (hidden comment: CL05A105JQ5NNNC)
C164  ValueDisplayed: 1µF  [0402]  (hidden comment: CL05A105JQ5NNNC)
C165  ValueDisplayed: 1µF  [0402]  (hidden comment: CL05A105JQ5NNNC)
C166  ValueDisplayed: 1µF  [0402]  (hidden comment: CL05A105JQ5NNNC)
C167  value 0.1uF  [0402]  (hidden comment: Capacitor)
C168  value 0.1uF  [0402]  (hidden comment: Capacitor)
C169  value 0.1uF  [0402]  (hidden comment: Capacitor)
C170  value 0.1uF  [0402]  (hidden comment: Capacitor)
C171  value 0.1uF  [0402]  (hidden comment: Capacitor)
C172  value 0.1uF  [0402]  (hidden comment: Capacitor)
C176  value 1uF  [0402]  (hidden comment: Capacitor)
C177  value 1uF  [0402]  (hidden comment: Capacitor)
C178  value 1uF  [0402]  (hidden comment: Capacitor)
C227  ValueDisplayed: 0.033µF  [0402]  (hidden comment: 0402YD333KAT2A)
C248  ValueDisplayed: 0.033µF  [0402]  (hidden comment: 0402YD333KAT2A)
R103  value 0  [0402]  (hidden comment: Resistor)
R104  ValueDisplayed: 49.9k  [0402]  (hidden comment: Resistor)
R105  ValueDisplayed: 100  [0402]  (hidden comment: Resistor)
R106  ValueDisplayed: 100  [0402]  (hidden comment: Resistor)
R107  ValueDisplayed: 100  [0402]  (hidden comment: Resistor)
R179  ValueDisplayed: 49.9k  [0402]  (hidden comment: Resistor)
R180  ValueDisplayed: 3.57k  [0402]  (hidden comment: Resistor)
R181  ValueDisplayed: 100  [0402]  (hidden comment: Resistor)
R182  ValueDisplayed: 3.57k  [0402]  (hidden comment: Resistor)
R183  ValueDisplayed: 100  [0402]  (hidden comment: Resistor)
R184  ValueDisplayed: 5.00k  [0402]  (hidden comment: Resistor)
R185  ValueDisplayed: 5.00k  [0402]  (hidden comment: Resistor)
R186  ValueDisplayed: 30k  [0402]  (hidden comment: Resistor)
R187  ValueDisplayed: 100  [0402]  (hidden comment: Resistor)
TP50  5003  [Keystone5003]  (value not drawn)
TP51  5003  [Keystone5003]  (value not drawn)
TP52  5003  [Keystone5003]  (value not drawn)
U1  AFE58JD32LPZAV  [ZAV0289A]  (parts A,B,C,D,E,F,G,H,I,J,K,L,M of 13)

### Blocks framed on the sheet
Device Pin configuration: U1
Power Supply: U1
LVDS/JESD Output: C163-C166 C227 C248 R104 R179-R187 U1
SPI: R103 U1
Input Clock: C167-C172 R105-R107 U1
Digital Inputs: C176-C178 TP50-TP52 U1
CW Output: U1

### Ports
ADC_CLKM (in), ADC_CLKP (in), AFE_RESET (in), CLKM_1X (in), CLKM_16X (in), CLKP_1X (in), CLKP_16X (in), CML1_OUTM (out), CML1_OUTP (out), CML2_OUTM (out), CML2_OUTP (out), CML3_OUTM (out), CML3_OUTP (out), CML4_OUTM (out), CML4_OUTP (out), CML5_OUTM (out), CML5_OUTP (out), CML6_OUTM (out), CML6_OUTP (out), CML7_OUTM (out), CML7_OUTP (out), CML8_OUTM (out), CML8_OUTP (out), CW_I_OUT_M (out), CW_I_OUT_P (out), CW_Q_OUT_M (out), CW_Q_OUT_P (out), DCLKM (out), DCLKP (out), DIG_SPI_EN (in), DIS_HPF_INTEG (bidir), DOUTM1 (out), DOUTM2 (out), DOUTM3 (out), DOUTM4 (out), DOUTM5 (out), DOUTM6 (out), DOUTM7 (out), DOUTM8 (out), DOUTM9 (out), DOUTM10 (out), DOUTM11 (out), DOUTM12 (out), DOUTM13 (out), DOUTM14 (out), DOUTM15 (out), DOUTM16 (out), DOUTP1 (out), DOUTP2 (out), DOUTP3 (out), DOUTP4 (out), DOUTP5 (out), DOUTP6 (out), DOUTP7 (out), DOUTP8 (out), DOUTP9 (out), DOUTP10 (out), DOUTP11 (out), DOUTP12 (out), DOUTP13 (out), DOUTP14 (out), DOUTP15 (out), DOUTP16 (out), FCLKM (out), FCLKP (out), INM1 (in), INM2 (in), INM3 (in), INM4 (in), INM5 (in), INM6 (in), INM7 (in), INM8 (in), INM9 (in), INM10 (in), INM11 (in), INM12 (in), INM13 (in), INM14 (in), INM15 (in), INM16 (in), INM17 (in), INM18 (in), INM19 (in), INM20 (in), INM21 (in), INM22 (in), INM23 (in), INM24 (in), INM25 (in), INM26 (in), INM27 (in), INM28 (in), INM29 (in), INM30 (in), INM31 (in), INM32 (in), INM[1..32] (out), INP1 (in), INP2 (in), INP3 (in), INP4 (in), INP5 (in), INP6 (in), INP7 (in), INP8 (in), INP9 (in), INP10 (in), INP11 (in), INP12 (in), INP13 (in), INP14 (in), INP15 (in), INP16 (in), INP17 (in), INP18 (in), INP19 (in), INP20 (in), INP21 (in), INP22 (in), INP23 (in), INP24 (in), INP25 (in), INP26 (in), INP27 (in), INP28 (in), INP29 (in), INP30 (in), INP31 (in), INP32 (in), INP[1..32] (out), PDN_FAST (in), PDN_GLOBAL (in), SCLK, SDATA, SDOUT (out), SENT (in), SYNCM_SERDES (out), SYNCP_SERDES (out), SYSREFM_EXT (out), SYSREFM_SERDES (out), SYSREFP_EXT (out), SYSREFP_SERDES (out), TGC_PROF_1 (in), TGC_PROF_2 (in), TGC_SLOPE (in), TGC_UP_DN (in), TX_TRG (in)

### Nets
AGND: C176.2 C177.2 C178.2
AVDD_1.8: U1.K6(AVDD_1P8) U1.K7(AVDD_1P8) U1.K11(AVDD_1P8) U1.K12(AVDD_1P8) U1.L6(AVDD_1P8) U1.L7(AVDD_1P8) U1.L11(AVDD_1P8) U1.L12(AVDD_1P8)
AVDD_3.0: U1.E6(AVDD_3P0) U1.E7(AVDD_3P0) U1.E10(AVDD_3P0) U1.E11(AVDD_3P0) U1.E12(AVDD_3P0)
AVDD_VCA_1.8: U1.F6(AVDD_VCA_1P8) U1.F7(AVDD_VCA_1P8) U1.F11(AVDD_VCA_1P8) U1.F12(AVDD_VCA_1P8) U1.G6(AVDD_VCA_1P8) U1.G7(AVDD_VCA_1P8) U1.G11(AVDD_VCA_1P8) U1.G12(AVDD_VCA_1P8) U1.H6(AVDD_VCA_1P8) U1.H7(AVDD_VCA_1P8) U1.H11(AVDD_VCA_1P8) U1.H12(AVDD_VCA_1P8) U1.H13(AVDD_VCA_1P8) U1.J6(AVDD_VCA_1P8) U1.J7(AVDD_VCA_1P8) U1.J11(AVDD_VCA_1P8) U1.J12(AVDD_VCA_1P8)
DVDD_1.2: U1.L3(DVDD_1P2) U1.M4(DVDD_1P2) U1.M5(DVDD_1P2) U1.M6(DVDD_1P2) U1.M12(DVDD_1P2) U1.M13(DVDD_1P2) U1.M14(DVDD_1P2) U1.N2(DVDD_1P2) U1.N3(DVDD_1P2) U1.N4(DVDD_1P2) U1.N5(DVDD_1P2) U1.N6(DVDD_1P2) U1.N12(DVDD_1P2) U1.N13(DVDD_1P2) U1.N14(DVDD_1P2) U1.N15(DVDD_1P2) U1.N16(DVDD_1P2) U1.P2(DVDD_1P2) U1.P3(DVDD_1P2) U1.P15(DVDD_1P2) U1.P16(DVDD_1P2)
DVDD_1.8: R104.2 R179.2 U1.P4(DVDD_1P8) U1.P5(DVDD_1P8) U1.P6(DVDD_1P8) U1.P7(DVDD_1P8) U1.P11(DVDD_1P8) U1.P12(DVDD_1P8) U1.P13(DVDD_1P8) U1.P14(DVDD_1P8)
GND: R184.1 R185.1 R186.1 U1.E1(AVSS) U1.E2(AVSS) U1.E3(AVSS) U1.E15(AVSS) U1.E16(AVSS) U1.E17(AVSS) U1.F3(AVSS) U1.F8(AVSS) U1.F9(AVSS) U1.F10(AVSS) U1.F15(AVSS) U1.G3(AVSS) U1.G8(AVSS) U1.G9(AVSS) U1.G10(AVSS) U1.G15(AVSS) U1.G16(AVSS) U1.G17(AVSS) U1.H1(AVSS) U1.H2(AVSS) U1.H3(AVSS) U1.H8(AVSS) U1.H9(AVSS) U1.H10(AVSS) U1.J3(AVSS) U1.J8(AVSS) U1.J9(AVSS) U1.J10(AVSS) U1.K1(AVSS) U1.K2(AVSS) U1.K3(AVSS) U1.K8(AVSS) U1.K9(AVSS) U1.K10(AVSS) U1.L8(AVSS) U1.L9(AVSS) U1.L10(AVSS) U1.M3(DVSS) U1.M7(DVSS) U1.M8(DVSS) U1.M9(DVSS) U1.M10(DVSS) U1.M11(DVSS) U1.N7(DVSS) U1.N8(DVSS) U1.N9(DVSS) U1.N10(DVSS) U1.N11(DVSS) U1.P8(DVSS) U1.P9(DVSS) U1.P10(DVSS)
ADC_CLKM: C172.2 ; port ADC_CLKM
ADC_CLKP: C171.2 ; port ADC_CLKP
AFE_RESET: U1.L17(RESET) ; port AFE_RESET
CLKM_1X: C170.2 ; port CLKM_1X
CLKM_16X: C168.2 ; port CLKM_16X
CLKP_1X: C169.2 ; port CLKP_1X
CLKP_16X: C167.2 ; port CLKP_16X
CML1_OUTM: U1.P17(CML1_OUTM) ; port CML1_OUTM
CML1_OUTP: U1.N17(CML1_OUTP) ; port CML1_OUTP
CML2_OUTM: U1.T17(CML2_OUTM) ; port CML2_OUTM
CML2_OUTP: U1.R17(CML2_OUTP) ; port CML2_OUTP
CML3_OUTM: U1.U16(CML3_OUTM) ; port CML3_OUTM
CML3_OUTP: U1.U17(CML3_OUTP) ; port CML3_OUTP
CML4_OUTM: U1.U14(CML4_OUTM) ; port CML4_OUTM
CML4_OUTP: U1.U15(CML4_OUTP) ; port CML4_OUTP
CML5_OUTM: U1.P1(CML5_OUTM) ; port CML5_OUTM
CML5_OUTP: U1.N1(CML5_OUTP) ; port CML5_OUTP
CML6_OUTM: U1.T1(CML6_OUTM) ; port CML6_OUTM
CML6_OUTP: U1.R1(CML6_OUTP) ; port CML6_OUTP
CML7_OUTM: U1.U2(CML7_OUTM) ; port CML7_OUTM
CML7_OUTP: U1.U1(CML7_OUTP) ; port CML7_OUTP
CML8_OUTM: U1.U4(CML8_OUTM) ; port CML8_OUTM
CML8_OUTP: U1.U3(CML8_OUTP) ; port CML8_OUTP
CPLD_IO_4: U1.J14(DIS_HPF_INTEG) ; port DIS_HPF_INTEG
CW_I_OUT_M: U1.F2(CW_IP_OUTM) ; port CW_I_OUT_M
CW_I_OUT_P: U1.F1(CW_IP_OUTP) ; port CW_I_OUT_P
CW_Q_OUT_M: U1.G2(CW_QP_OUTM) ; port CW_Q_OUT_M
CW_Q_OUT_P: U1.G1(CW_QP_OUTP) ; port CW_Q_OUT_P
DCLKM: U1.U9(DCLKM) ; port DCLKM
DCLKP: U1.T9(DCLKP) ; port DCLKP
DIG_SPI_EN: U1.K16(SPI_DIG_EN) ; port DIG_SPI_EN
DOUTM1: U1.T16(DOUTM1) ; port DOUTM1
DOUTM2: U1.T15(DOUTM2) ; port DOUTM2
DOUTM3: U1.T14(DOUTM3) ; port DOUTM3
DOUTM4: U1.U13(DOUTM4) ; port DOUTM4
DOUTM5: U1.U12(DOUTM5) ; port DOUTM5
DOUTM6: U1.R11(DOUTM6) ; port DOUTM6
DOUTM7: U1.U11(DOUTM7) ; port DOUTM7
DOUTM8: U1.U10(DOUTM8) ; port DOUTM8
DOUTM9: U1.U8(DOUTM9) ; port DOUTM9
DOUTM10: U1.U7(DOUTM10) ; port DOUTM10
DOUTM11: U1.R6(DOUTM11) ; port DOUTM11
DOUTM12: U1.U6(DOUTM12) ; port DOUTM12
DOUTM13: U1.U5(DOUTM13) ; port DOUTM13
DOUTM14: U1.T4(DOUTM14) ; port DOUTM14
DOUTM15: U1.T3(DOUTM15) ; port DOUTM15
DOUTM16: U1.T2(DOUTM16) ; port DOUTM16
DOUTP1: U1.R16(DOUTP1) ; port DOUTP1
DOUTP2: U1.R15(DOUTP2) ; port DOUTP2
DOUTP3: U1.R14(DOUTP3) ; port DOUTP3
DOUTP4: U1.T13(DOUTP4) ; port DOUTP4
DOUTP5: U1.T12(DOUTP5) ; port DOUTP5
DOUTP6: U1.R12(DOUTP6) ; port DOUTP6
DOUTP7: U1.T11(DOUTP7) ; port DOUTP7
DOUTP8: U1.T10(DOUTP8) ; port DOUTP8
DOUTP9: U1.T8(DOUTP9) ; port DOUTP9
DOUTP10: U1.T7(DOUTP10) ; port DOUTP10
DOUTP11: U1.R7(DOUTP11) ; port DOUTP11
DOUTP12: U1.T6(DOUTP12) ; port DOUTP12
DOUTP13: U1.T5(DOUTP13) ; port DOUTP13
DOUTP14: U1.R4(DOUTP14) ; port DOUTP14
DOUTP15: U1.R3(DOUTP15) ; port DOUTP15
DOUTP16: U1.R2(DOUTP16) ; port DOUTP16
FCLKM: U1.R8(FCLKM) ; port FCLKM
FCLKP: U1.R10(FCLKP) ; port FCLKP
INM1: U1.B17(INM1) ; port INM1
INM2: U1.D17(INM2) ; port INM2
INM3: U1.B16(INM3) ; port INM3
INM4: U1.D16(INM4) ; port INM4
INM5: U1.B15(INM5) ; port INM5
INM6: U1.D15(INM6) ; port INM6
INM7: U1.B14(INM7) ; port INM7
INM8: U1.D14(INM8) ; port INM8
INM9: U1.B13(INM9) ; port INM9
INM10: U1.D13(INM10) ; port INM10
INM11: U1.B12(INM11) ; port INM11
INM12: U1.D12(INM12) ; port INM12
INM13: U1.B11(INM13) ; port INM13
INM14: U1.D11(INM14) ; port INM14
INM15: U1.B10(INM15) ; port INM15
INM16: U1.D10(INM16) ; port INM16
INM17: U1.B8(INM17) ; port INM17
INM18: U1.D8(INM18) ; port INM18
INM19: U1.B7(INM19) ; port INM19
INM20: U1.D7(INM20) ; port INM20
INM21: U1.B6(INM21) ; port INM21
INM22: U1.D6(INM22) ; port INM22
INM23: U1.B5(INM23) ; port INM23
INM24: U1.D5(INM24) ; port INM24
INM25: U1.B4(INM25) ; port INM25
INM26: U1.D4(INM26) ; port INM26
INM27: U1.B3(INM27) ; port INM27
INM28: U1.D3(INM28) ; port INM28
INM29: U1.B2(INM29) ; port INM29
INM30: U1.D2(INM30) ; port INM30
INM31: U1.B1(INM31) ; port INM31
INM32: U1.D1(INM32) ; port INM32
INP1: U1.A17(INP1) ; port INP1
INP2: U1.C17(INP2) ; port INP2
INP3: U1.A16(INP3) ; port INP3
INP4: U1.C16(INP4) ; port INP4
INP5: U1.A15(INP5) ; port INP5
INP6: U1.C15(INP6) ; port INP6
INP7: U1.A14(INP7) ; port INP7
INP8: U1.C14(INP8) ; port INP8
INP9: U1.A13(INP9) ; port INP9
INP10: U1.C13(INP10) ; port INP10
INP11: U1.A12(INP11) ; port INP11
INP12: U1.C12(INP12) ; port INP12
INP13: U1.A11(INP13) ; port INP13
INP14: U1.C11(INP14) ; port INP14
INP15: U1.A10(INP15) ; port INP15
INP16: U1.C10(INP16) ; port INP16
INP17: U1.A8(INP17) ; port INP17
INP18: U1.C8(INP18) ; port INP18
INP19: U1.A7(INP19) ; port INP19
INP20: U1.C7(INP20) ; port INP20
INP21: U1.A6(INP21) ; port INP21
INP22: U1.C6(INP22) ; port INP22
INP23: U1.A5(INP23) ; port INP23
INP24: U1.C5(INP24) ; port INP24
INP25: U1.A4(INP25) ; port INP25
INP26: U1.C4(INP26) ; port INP26
INP27: U1.A3(INP27) ; port INP27
INP28: U1.C3(INP28) ; port INP28
INP29: U1.A2(INP29) ; port INP29
INP30: U1.C2(INP30) ; port INP30
INP31: U1.A1(INP31) ; port INP31
INP32: U1.C1(INP32) ; port INP32
K4: U1.K4(NC)
K5: U1.K5(NC)
PDN_FAST: U1.M17(PDN_FAST) ; port PDN_FAST
PDN_GLOBAL: U1.M16(PDN_GBL) ; port PDN_GLOBAL
SCLK: U1.J17(SCLK) ; port SCLK
SDATA: U1.L16(SDIN) ; port SDATA
SDOUT: U1.J16(SDOUT) ; port SDOUT
SENT: R103.1 ; port SENT
SYNCM_SERDES: C248.2 R181.1 R182.1 ; port SYNCM_SERDES
SYNCP_SERDES: C227.2 R180.1 R181.2 ; port SYNCP_SERDES
SYSREFM_EXT: C166.2 R187.1 ; port SYSREFM_EXT
SYSREFM_SERDES: C164.2 R183.1 ; port SYSREFM_SERDES
SYSREFP_EXT: C165.2 R187.2 ; port SYSREFP_EXT
SYSREFP_SERDES: C163.2 R183.2 ; port SYSREFP_SERDES
TGC_PROF_1: U1.J5(TGC_PROF[1]) ; port TGC_PROF_1
TGC_PROF_2: U1.H5(TGC_PROF[2]) ; port TGC_PROF_2
TGC_SLOPE: U1.H4(TGC_SLOPE) ; port TGC_SLOPE
TGC_UP_DN: U1.J4(TGC_UP_DN) ; port TGC_UP_DN
TX_TRG: U1.M15(TX_TRIG) ; port TX_TRG
NetC163_1: C163.1 C165.1 R186.2 U1.M1(SYSREFP_SERDES)
NetC164_1: C164.1 C166.1 R179.1 U1.M2(SYSREFM_SERDES)
NetC167_1: C167.1 R105.1 U1.F16(CLKP_16X)
NetC168_1: C168.1 R105.2 U1.F17(CLKM_16X)
NetC169_1: C169.1 R106.1 U1.H17(CLKP_1X)
NetC170_1: C170.1 R106.2 U1.H16(CLKM_1X)
NetC171_1: C171.1 R107.1 U1.J1(ADC_CLKP)
NetC172_1: C172.1 R107.2 U1.J2(ADC_CLKM)
NetC176_1: C176.1 TP50.1 U1.A9(BIAS_0P75)
NetC177_1: C177.1 TP51.1 U1.G4(BIAS_1P2)
NetC178_1: C178.1 TP52.1 U1.G5(BIAS_2P8)
NetC227_1: C227.1 R104.1 R180.2 R184.2 U1.L1(SYNCP_SERDES)
NetC248_1: C248.1 R182.2 R185.2 U1.L2(SYNCM_SERDES)
NetR103_2: R103.2 U1.K17(~{SEN})

Not connected (* = marked no-connect by the designer): U1 B9(NC)* C9(NC)* D9(NC)* E4(NC)* E5(NC)* E8(NC)* E9(NC)* E13(NC)* E14(NC)* F4(NC)* F5(NC)* F13(NC)* F14(NC)* G13(NC)* G14(NC)* H14(NC)* H15(NC)* J13(NC)* J15(NC)* K13(NC)* K14(NC)* K15(NC)* L4(NC)* L5(NC)* L13(NC)* L14(NC)* L15(NC)* R5(NC)* R9(NC)* R13(NC)*

### Buses and harness runs
bus INM[1..32] = port INM[1..32]
bus INP[1..32] = port INP[1..32]

### Notes on the sheet
- (near U1) Analog Inputs
- Drawn By:
- SVN Rev:
- Number:
- TID #:
- Orderable:
- Rev:
- Sheet Title:
- File:
- Project Title:
- Designed for:
- Assembly Variant:
- Mod. Date:
- Sheet:
- Size:
- of
- C
- http://www.ti.com
- Texas Instruments and/or its licensors do not warrant the accuracy or completeness of this specification or any information contained therein. Texas Instruments and/or its licensors do not warrant that this design will meet the specifications, will be suitable for your application or fit for any particular purpose, or will operate in an implementation. Texas Instruments and/or its licensors do not warrant that the design is production worthy. You should completely validate and test your design implementation to confirm the system functionality for your application.
- Engineer:
- Contact:
- © Texas Instruments

### Library data of the parts
C163-C166 = CMP-0085575-1: CAP, CERM, 1 µF, 6.3 V,+/- 5%, X5R, 0402; Manufacturer: Samsung Electro-Mechanics; Polarized: N; Value: 1uF; U/M: EA; VDC_V: 6.3V; TaMin_C: -55°C; TaMax_C: 85°C; SizeArea_mm2: 0.5; SizeAreaWB_mm2: 3; SizeX_mm: 1; SizeZ_mm: 0.6; AEC Category: Q200; CompType: Capacitor; PartNumber: CL05A105JQ5NNNC; PackageReference: 0402; RoHS: Y; Cap_F: 1µF; Tolerance_%: 5%; Value2: 6.3V; MountType: SMT; Technology: Ceramic; TempCo: X5R; Cap_Case: 0402; ComponentLink1Description: Datasheet link; ComponentLink1URL: http://www.samsungsem.com/kr/support/product-search/mlcc/__icsFiles/afieldfile/2018/06/19/CL05A105JQ5NNNC.pdf; SizeY_mm: 0.5; AEC Qualified: N; AEC Grade: N/A
C167-C172 = CMP-0006641-2: CAP, CERM, 0.1 uF, 16 V, +/- 10%, X7R, 0402; PartNumber: GRM155R71C104KA88D; Manufacturer: MuRata; Polarized: N; U/M: EA; Cap_F: 100nF; Value1: Unknown; VDC_V: 16V; TaMin_C: -55°C; TaMax_C: 125°C; AEC Category: Q200; SizeArea_mm2: 0.5; SizeAreaWB_mm2: 3; SizeX_mm: 1; SizeZ_mm: 0.6; CompType: Capacitor; ValueDisplayed: 0.1uF; PackageReference: 0402; RoHS: Y; Tolerance_%: 10%; Value2: 16V; MountType: SMT; Technology: Ceramic; TempCo: X7R; Cap_Case: 0402; Published: 2008-06-19; Publisher: Texas Instruments; LatestRevisionDate: 2017-03-09; ComponentLink1Description: Datasheet link; ComponentLink1URL: http://search.murata.co.jp/Ceramy/PnsearchViewAction.do?HnOFG=ON&HnNFG=ON&SEL_CNT=50&sLang=en&sKey=GRM155R71C104KA88D&x=9&y=9&search=startwith; Supplier 1: Digi-Key; Supplier Part Number 1: 490-3261-1-ND; Supplier 2: Newark; Supplier Part Number 2: 38K1647; Supplier 3: Mouser; Supplier Part Number 3: 81-GRM155R71C104KA88; AEC Qualified: ?; SizeY_mm: 0.5
C176-C178 = CMP-0006372-2: CAP, CERM, 1 uF, 6.3 V, +/- 20%, X5R, 0402; PartNumber: GRM152R60J105ME15D; Manufacturer: MuRata; Polarized: N; U/M: EA; Cap_F: 1µF; Value1: Unknown; VDC_V: 6.3V; TaMin_C: -55°C; TaMax_C: 85°C; AEC Category: Q200; SizeArea_mm2: 0.5; SizeAreaWB_mm2: 3; SizeX_mm: 1; SizeZ_mm: 0.6; CompType: Capacitor; PackageReference: 0402; RoHS: Y; MountType: SMT; ComponentLink1Description: Datasheet link; ComponentLink1URL: http://psearch.murata.com/capacitor/product/GRM152R60J105ME15%23.pdf; ValueDisplayed: 1uF; Tolerance_%: 20%; Value2: 6.3V; Technology: Ceramic; TempCo: X5R; Cap_Case: 0402; Published: 2008-06-19; Publisher: Texas Instruments; LatestRevisionDate: 2017-03-09; Supplier 1: Digi-Key; Supplier Part Number 1: 490-10006-1-ND; Supplier 2: Mouser; Supplier Part Number 2: 81-GRM152R60J105ME5D; AEC Qualified: ?; SizeY_mm: 0.5
C227 C248 = CMP-0085569-1: CAP, CERM, 0.033 µF, 16 V,+/- 10%, X5R, 0402; Manufacturer: AVX; Polarized: N; Value: 0.033uF; U/M: EA; Cap_F: 33nF; VDC_V: 16V; TaMin_C: -55°C; TaMax_C: 85°C; SizeArea_mm2: 0.5; SizeAreaWB_mm2: 3; SizeX_mm: 1; SizeZ_mm: 0.6; AEC Category: Q200; CompType: Capacitor; PartNumber: 0402YD333KAT2A; PackageReference: 0402; RoHS: Y; Tolerance_%: 10%; Value2: 16V; MountType: SMT; Technology: Ceramic; TempCo: X5R; Cap_Case: 0402; ComponentLink1Description: Datasheet link; ComponentLink1URL: http://datasheets.avx.com/cx5r.pdf; SizeY_mm: 0.5; AEC Qualified: N; AEC Grade: N/A
R103 = CMP-0026822-3: as R33 on sheet DC075B_ANALOG_INPUTS; ComponentLink1Description: Datasheet link; ComponentLink1URL: http://www.vishay.com/docs/20035/dcrcwe3.pdf; CompType: Resistor; MountType: SMT; PackageReference: 0402; RoHS: E; ValueDisplayed: 0; Res_ohm: 0; Tolerance_%: 5%; Value1: 5%; Technology: Thick Film; Supplier 1: Digi-Key; Supplier Part Number 1: 541-0.0JCT-ND; Supplier 2: Newark; Supplier Part Number 2: 52K6543; Supplier 3: Mouser; Supplier Part Number 3: 71-CRCW0402-0-E3; AEC Grade: 0; SizeY_mm: 0.5
R104 R179 = CMP-0026403-2: RES, 49.9 k, 1%, 0.063 W, AEC-Q200 Grade 0, 0402; PartNumber: CRCW040249K9FKED; Manufacturer: Vishay-Dale; Value: 49.9k; Value_Code: 49k9; Power_W: 63mW; Value2: 0.063W; VDC_V: 50V; TempCo: 100 ppm/C; SizeArea_mm2: 0.5; SizeX_mm: 1; SizeZ_mm: 0.6; EIA_Code: E96; AEC Category: Q200; AEC Qualified: Y; AEC Grade: 0; CompType: Resistor; PackageReference: 0402; RoHS: E; Res_ohm: 49.9k; Tolerance_%: 1%; Value1: 1%; MountType: SMT; Technology: Thick Film; SizeY_mm: 0.5; ComponentLink1Description: Datasheet link; ComponentLink1URL: http://www.vishay.com/docs/20035/dcrcwe3.pdf; Supplier 1: Digi-Key; Supplier Part Number 1: 541-49.9KLCT-ND; Supplier 2: Newark; Supplier Part Number 2: 52K7113; Supplier 3: Mouser; Supplier Part Number 3: 71-CRCW0402-49.9K-E3
R105-R107 R181 R183 R187 = CMP-0026656-1: RES, 100, 1%, 0.1 W, 0402; Manufacturer: Panasonic; PartNumber: ERJ-2RKF1000X; Value: 100; Value_Code: 100R; Power_W: 100mW; Value2: 0.1W; VDC_V: 50V; TempCo: 100 ppm/C; EIA_Code: E96; U/M: EA; AEC Category: Q200; SizeArea_mm2: 0.5; SizeX_mm: 1; SizeZ_mm: 0.6; ComponentLink1Description: Datasheet link; ComponentLink1URL: http://industrial.panasonic.com/www-data/pdf/AOA0000/AOA0000CE2.pdf; CompType: Resistor; MountType: SMT; PackageReference: 0402; RoHS: Y; Res_ohm: 100; Tolerance_%: 1%; Value1: 1%; Technology: Thick Film; Published: 2008-06-26; Publisher: Texas Instruments; LatestRevisionDate: 2017-03-09; Supplier 1: Digi-Key; Supplier Part Number 1: P100LCT-ND; Supplier 2: Newark; Supplier Part Number 2: 64R5246; Supplier 3: Mouser; Supplier Part Number 3: 667-ERJ-2RKF1000X; AEC Qualified: ?; SizeY_mm: 0.5
R180 R182 = CMP-0026336-2: RES, 3.57 k, 1%, 0.063 W, AEC-Q200 Grade 0, 0402; PartNumber: CRCW04023K57FKED; Manufacturer: Vishay-Dale; Value: 3.57k; Value_Code: 3k57; Power_W: 63mW; Value2: 0.063W; VDC_V: 50V; TempCo: 100 ppm/C; SizeArea_mm2: 0.5; SizeX_mm: 1; SizeZ_mm: 0.6; EIA_Code: E96; AEC Category: Q200; AEC Qualified: Y; AEC Grade: 0; CompType: Resistor; PackageReference: 0402; RoHS: E; Res_ohm: 3.57k; Tolerance_%: 1%; Value1: 1%; MountType: SMT; Technology: Thick Film; SizeY_mm: 0.5; ComponentLink1Description: Datasheet link; ComponentLink1URL: http://www.vishay.com/docs/20035/dcrcwe3.pdf; Supplier 1: Digi-Key; Supplier Part Number 1: 541-3.57KLCT-ND; Supplier 2: Newark; Supplier Part Number 2: 52K6946; Supplier 3: Mouser; Supplier Part Number 3: 71-CRCW0402-3.57K-E3
R184 R185 = CMP-0026813-1: RES, 5.00 k, 0.1%, 0.05 W, 0402; PartNumber: PNM0402E5001BST1; Manufacturer: Vishay-Dale; Value: 5.00k; Res_ohm: 5k; Value_Code: 5k00; Power_W: 50mW; Value2: 0.05W; VDC_V: 75V; TempCo: 25 ppm/C; SizeArea_mm2: 0.5; SizeX_mm: 1; SizeZ_mm: 0.6; U/M: EA; AEC Category: Q200; AEC Qualified: N; CompType: Resistor; PackageReference: 0402; RoHS: Y; Tolerance_%: 0.1%; Value1: 0.1%; MountType: SMT; Technology: Thin Film; SizeY_mm: 0.5; Published: 2008-06-26; Publisher: Texas Instruments; LatestRevisionDate: 2017-03-09; ComponentLink1Description: Datasheet link; ComponentLink1URL: http://www.vishay.com/docs/60057/pnm.pdf; Supplier 1: Digi-Key; Supplier Part Number 1: 541-1901-1-ND; Supplier 2: Mouser; Supplier Part Number 2: 71-PNM0402E5001BST1; AEC Grade: N/A
R186 = CMP-0026903-3: RES, 30 k, 5%, 0.063 W, AEC-Q200 Grade 0, 0402; PartNumber: CRCW040230K0JNED; Manufacturer: Vishay-Dale; Value: 30k; Value_Code: 30k0; Power_W: 63mW; Value2: 0.063W; VDC_V: 50V; TempCo: 200 ppm/C; SizeArea_mm2: 0.5; SizeX_mm: 1; SizeZ_mm: 0.6; EIA_Code: E24; AEC Category: Q200; AEC Qualified: Y; AEC Grade: 0; CompType: Resistor; PackageReference: 0402; RoHS: E; Res_ohm: 30k; Tolerance_%: 5%; Value1: 5%; MountType: SMT; Technology: Thick Film; SizeY_mm: 0.5; ComponentLink1Description: Datasheet link; ComponentLink1URL: http://www.vishay.com/docs/20035/dcrcwe3.pdf; Supplier 1: Digi-Key; Supplier Part Number 1: 541-30KJCT-ND; Supplier 2: Newark; Supplier Part Number 2: 59M6726; Supplier 3: Mouser; Supplier Part Number 3: 71-CRCW0402J-30K-E3
TP50-TP52 = CMP-0055140-1: Test Point, Miniature, Orange, TH; Manufacturer: Keystone; CNHeader: FALSE; ContactFinish: Silver; CT: TRUE; Green_Lifecycle: Active; Green_REACh: Passed; PartNumber: 5003; PackageReference: Orange Miniature Testpoint; CompType: Test Point; RoHS: Y; MountType: TH; ComponentLink1Description: Datasheet URL; ComponentLink1URL: http://www.keyelco.com/userAssets/file/M60-2p60.pdf; Publisher: Texas Instruments; LatestRevisionDate: 26/05/2017; Supplier 1: Digi-Key; Supplier Part Number 1: 36-5003-ND; Supplier 2: Mouser; Supplier Part Number 2: 534-5003; Color: Orange; Green_EU RoHS-2: Incomplete; Green_EU RoHS: Passed
U1 = CMP-0084577-3: 32-Channel Ultrasound AFE with 28-mW/Channel Power, 4 nV/√Hz, 12-Bit, 40-MSPS or 10-Bit, 50-MSPS output and Passive CW Mixer, ZAV0289A (NFBGA-289); Manufacturer: Texas Instruments; SizeArea_mm2: 225; SizeAreaWB_mm2: 289; SizeX_mm: 15; SizeZ_mm: 1.4; CompType: IC; AEC Category: Q200; AEC Qualified: N; PartNumber: AFE58JD32LPZAV; PackageReference: ZAV0289A; PackageDescription: NFBGA-289; MountType: SMT; SizeY_mm: 15; ComponentLink1Description: Datasheet Link; ComponentLink1URL: http://www.ti.com/lit/ds/symlink/afe58jd32lp.pdf; RoHS: Y; Alternate Manufacturer: Texas Instruments; ComponentLink2Description: Product Folder; ComponentLink2URL: http://www.ti.com/product/afe58jd32lp; ComponentLink3Description: Online Datasheet; ComponentLink3URL: http://www.ti.com/product/afe58jd32lp/datasheet